# EasyEDA Pro project ProProject_STM Embedded BD_2024-04-18.epro

# Schematic ATmega Embedded BD
Create Date: 2024-04-15; Page Name: 1 / 1; Project Name: STM Embedded BD; Schematic Name: ATmega Embedded BD; Update Date: 2024-04-16; Company: EasyEDA.com; Drawn: EasyEDA; Page Size: A4; Part Number: JLCPCB-002; Reviewed: EasyEDA; Version: V0.1
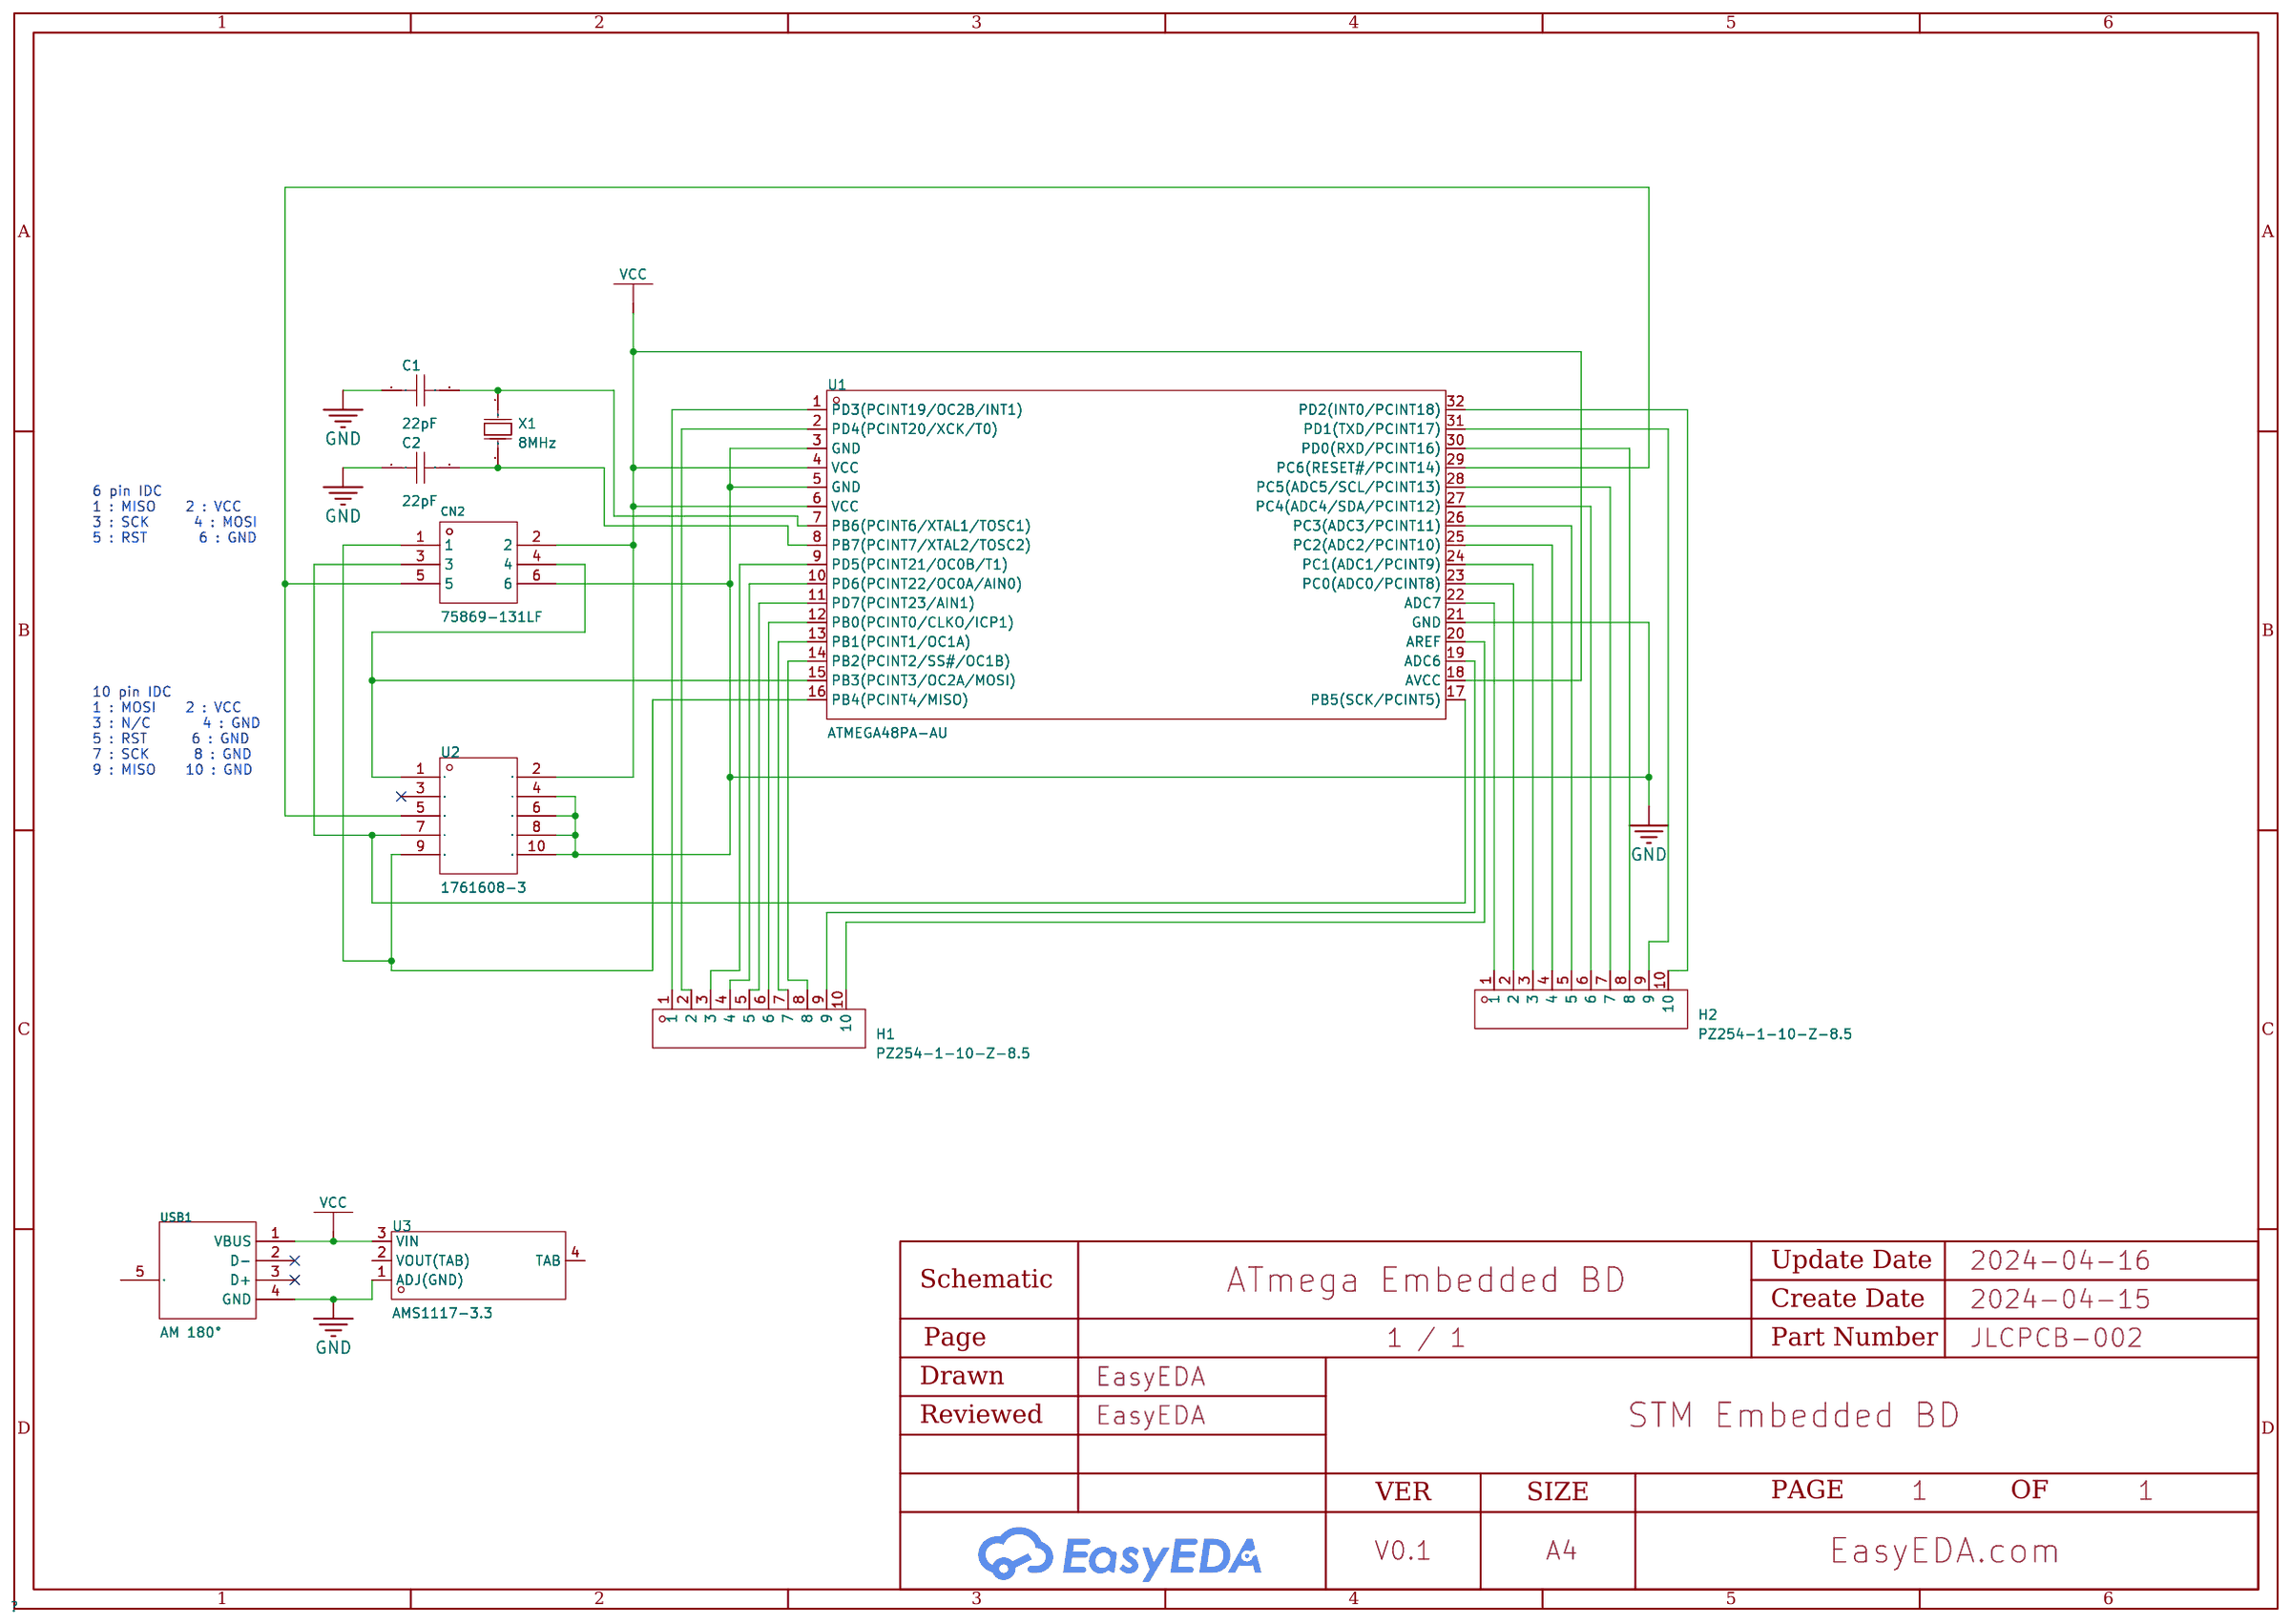
[diagram p0: schematic sheet]

## Parts
C1  22pF  [C0603]
C2  22pF  [C0603]
CN2  75869-131LF  [CONN-TH_6P-P2.54_75869-131LF]
H1  PZ254-1-10-Z-8.5  [HDR-TH_10P-P2.54-V-M]
H2  PZ254-1-10-Z-8.5  [HDR-TH_10P-P2.54-V-M]
U1  ATMEGA48PA-AU  [TQFP-32_L7.0-W7.0-P0.80-LS9.0-BL]
U2  1761608-3  [IDC-TH_10P-P2.54-S2.54_L9.2-W20.3]
U3  AMS1117-3.3  [SOT-223-4_L6.5-W3.5-P2.30-LS7.0-BR]
USB1  AM 180°  [USB-SMD_AM180]
X1  8MHz  [CRYSTAL-SMD_L11.5-W4.8-LS12.7]

## Library data of the parts
C1 C2 = 0603CG220J500NT: Capacitance: Tolerance:±5% Tolerance:±5% Voltage Rated: Temperature Coefficient:; LCSC Part Name: 22pF ±5% 50V; Supplier Part: C91701; Manufacturer: FH(风华); Supplier Footprint: 0603; JLCPCB Part Class: Extended Part; Datasheet: https://atta.szlcsc.com/upload/public/pdf/source/20200305/C486355_26A10D38EF8C2A5C37091D0039909270.pdf; Supplier: LCSC; Tolerance: ±5%
CN2 = 75869-131LF: Pins Structure:2x3P Pitch:2.54mm Mounting Style:Straight Reference Series:- Number of Pins:6P Number of Rows:2 Number of PINs Per Row:3 Row Spacing:2.54mm Contact Material:Phosphor bronze Contact Plating:Tin; LCSC Part Name: 间距:2.54mm 2x3P 直插 蓝色; Supplier Part: C168680; Manufacturer: Amphenol; Supplier Footprint: 插件,P=2.54mm; JLCPCB Part Class: Extended Part; Datasheet: https://atta.szlcsc.com/upload/public/pdf/source/20180316/C63A43DF70B4EBFBD28CCA94FAEE0128.pdf; Supplier: LCSC; Pins Structure: 2x3P; Pitch: 2.54mm; Mounting Style: Straight; Number of Pins: 6P; Number of Rows: 2; Number of PINs Per Row: 3; Row Spacing: 2.54mm; Contact Material: Phosphor bronze; Contact Plating: Tin
H1 H2 = PZ254-1-10-Z-8.5: Pin Structure:1x10P Pitch:2.54mm Row Spacing:- Circluar Pins/Square Pins:Square Pins Mounting Type:Straight Number of Rows:Plugin Number of Pins:10P Current Rating (Max):3A Voltage Rating (Max):- Length of Mating Pin:6mm Insulation Height:2.5mm Length of; LCSC Part Name: 1x10P 间距:2.54mm 方针 直插; Supplier Part: C2894933; Manufacturer: HCTL(华灿天禄); Supplier Footprint: 插件,P=2.54mm; JLCPCB Part Class: Extended Part; Datasheet: https://atta.szlcsc.com/upload/public/pdf/source/20240305/0F0A2A5C422E5D195558C9C26715A031.pdf; Supplier: LCSC; Pin Structure: 1x10P; Pitch: 2.54mm; Circluar Pins/Square Pins: Square Pins; Mounting Type: Straight; Number of Rows: Plugin; Number of Pins: 10P; Current Rating (Max): 3A; Length of Mating Pin: 6mm; Insulation Height: 2.5mm; Length of End Connection Pin: 3mm; Operating Temperature Range: -40℃~+105℃; Soldering Temperature(Max): 260℃@10S; Color: Black
U1 = ATMEGA48PA-AU: CPU Core:AVR Program Storage Size:4KB GPIO Ports Number:23 Operating Voltage Range:1.8V~5.5V Operating Voltage Range:1.8V~5.5V CPU Maximum Speed:20MHz Operating Temperature Range:-40℃~+85℃ Operating Temperature Range:-40℃~+85℃ ADC (Bit):10bit Watchdog:有 L; LCSC Part Name: 基于AVR增强型RISC架构的低功耗CMOS 8位微控制器; Supplier Part: C9433; Manufacturer: MICROCHIP(美国微芯); Supplier Footprint: TQFP-32(7x7); JLCPCB Part Class: Extended Part; Datasheet: https://atta.szlcsc.com/upload/public/pdf/source/20140724/1457707175179.pdf; Supplier: LCSC; CPU Core: AVR; Program Storage Size: 4KB; GPIO Ports Number: 23; Operating Voltage Range: 1.8V~5.5V; CPU Maximum Speed: 20MHz; Operating Temperature Range: -40℃~+85℃; ADC (Bit): 10bit; Watchdog: 有; Low-Voltage Detect: 有; Internal Oscillator: 有
U2 = 1761608-3: Pins Structure:2x5P Pitch:2.54mm Mounting Style:Straight Reference Series:- Number of Pins:10P Number of Rows:2 Number of PINs Per Row:5 Row Spacing:2.54mm Current Rating (Max):1A Contact Material:Phosphor bronze Contact Plating:Tin Operating Temperature; Supplier Part: C305912; Manufacturer: TE Connectivity(泰科电子); Supplier Footprint: 插件,P=2.5mm; JLCPCB Part Class: Extended Part; Datasheet: https://atta.szlcsc.com/upload/public/pdf/source/20181023/C305913_13B9A14E6BC94F99D9146D7418167983.pdf; Supplier: LCSC; Pins Structure: 2x5P; Pitch: 2.54mm; Mounting Style: Straight; Number of Pins: 10P; Number of Rows: 2; Number of PINs Per Row: 5; Row Spacing: 2.54mm; Current Rating (Max): 1A; Contact Material: Phosphor bronze; Contact Plating: Tin; Operating Temperature Range: -65℃~+105℃
U3 = AMS1117-3.3_C347222: Output Type: Maximum Input Voltage:12V Output Voltage:3.3V Output Voltage:3.3V MAX Output Current:1A Power Supply Rejection Ratio (PSRR):60dB@(120Hz) Dropout Voltage:1.3V@(1A) standby current:- Noise:- Feature:- Operating Temperature:- Operating Temperatu; LCSC Part Name: 输出:3.3V 电流:1A 耐压:12V; Supplier Part: C347222; Manufacturer: UMW(友台半导体); Supplier Footprint: SOT-223; JLCPCB Part Class: Extended Part; Datasheet: https://atta.szlcsc.com/upload/public/pdf/source/20231109/155D79A26D9DB04352555A58D5969DC8.pdf; Supplier: LCSC; Maximum Input Voltage: 12V; Output Voltage: 3.3V; MAX Output Current: 1A; Power Supply Rejection Ratio (PSRR): 60dB@(120Hz); Dropout Voltage: 1.3V@(1A); Output Polarity: Positive electrode; Number of Outputs: 1
USB1 = AM 180°: Connector Type:Type-A Standard:USB 2.0 Gender:公 Number of Ports:1 Number of Contacts:4P Mounting Style:卧贴 Current Rating - Power (Max):1A Operating Temperature Range:-40℃~+60℃ Operating Temperature Range:-40℃~+60℃; LCSC Part Name: Type-A 公 卧贴; Supplier Part: C2681564; Manufacturer: SHOU HAN(首韩); Supplier Footprint: SMD; JLCPCB Part Class: Extended Part; Datasheet: https://atta.szlcsc.com/upload/public/pdf/source/20210107/C2681564_25DA62A2D5638CEDBC3A14F60B11E72F.pdf; Supplier: LCSC; Connector Type: Type-A; Standard: USB 2.0; Gender: 公; Number of Ports: 1; Number of Contacts: 4P; Mounting Style: 卧贴; Current Rating - Power (Max): 1A; Operating Temperature Range: -40℃~+60℃
X1 = X49SM8MSD2SC: Crystal Type:贴片晶振 Frequency: Normal temperature Frequency Tolerance:±20ppm Normal temperature Frequency Tolerance:±20ppm External load capacitor: Frequency Stability(Full temperature range):±30ppm Frequency Stability(Full temperature range):±30ppm Operati; LCSC Part Name: 8MHz ±20ppm 20pF; Supplier Part: C12674; Manufacturer: YXC(扬兴晶振); Supplier Footprint: HC-49S-SMD; JLCPCB Part Class: Basic Part; Datasheet: https://atta.szlcsc.com/upload/public/pdf/source/20240329/3EBF42EBCAB50CA65B6FA9D7CFA1955A.pdf; Supplier: LCSC; Crystal Type: 贴片晶振; Normal temperature Frequency Tolerance: ±20ppm; Frequency Stability(Full temperature range): ±30ppm

## Nets
GND: C1.1 C2.1 CN2.6 U1.3(GND) U1.5(GND) U1.21(GND) U2.4 U2.6 U2.8 U2.10 U3.1(ADJ(GND)) USB1.4(GND)
VCC: CN2.2 U1.4(VCC) U1.6(VCC) U1.18(AVCC) U2.2 U3.3(VIN) USB1.1(VBUS)
$2N830: CN2.4 U1.15(PB3(PCINT3/OC2A/MOSI)) U2.1
$2N839: CN2.1 U1.16(PB4(PCINT4/MISO)) U2.9
$2N858: CN2.3 U1.17(PB5(SCK/PCINT5)) U2.7
$2N878: CN2.5 U1.29(PC6(RESET#/PCINT14)) U2.5
$2N1111: C1.2 U1.7(PB6(PCINT6/XTAL1/TOSC1)) X1.1(OSC1)
$2N1119: C2.2 U1.8(PB7(PCINT7/XTAL2/TOSC2)) X1.2(OSC2)
$2N1346: H1.1 U1.1(PD3(PCINT19/OC2B/INT1))
$2N1350: H1.2 U1.2(PD4(PCINT20/XCK/T0))
$2N1360: H1.3 U1.9(PD5(PCINT21/OC0B/T1))
$2N1374: H1.4 U1.10(PD6(PCINT22/OC0A/AIN0))
$2N1380: H1.5 U1.11(PD7(PCINT23/AIN1))
$2N1390: H1.6 U1.12(PB0(PCINT0/CLKO/ICP1))
$2N1398: H1.7 U1.13(PB1(PCINT1/OC1A))
$2N1410: H1.8 U1.14(PB2(PCINT2/SS#/OC1B))
$2N1422: H1.9 U1.19(ADC6)
$2N1434: H1.10 U1.20(AREF)
$2N1448: H2.1 U1.22(ADC7)
$2N1452: H2.2 U1.23(PC0(ADC0/PCINT8))
$2N1456: H2.3 U1.24(PC1(ADC1/PCINT9))
$2N1460: H2.4 U1.25(PC2(ADC2/PCINT10))
$2N1464: H2.5 U1.26(PC3(ADC3/PCINT11))
$2N1472: H2.6 U1.27(PC4(ADC4/SDA/PCINT12))
$2N1480: H2.7 U1.28(PC5(ADC5/SCL/PCINT13))
$2N1488: H2.8 U1.30(PD0(RXD/PCINT16))
$2N1496: H2.9 U1.31(PD1(TXD/PCINT17))
$2N1514: H2.10 U1.32(PD2(INT0/PCINT18))

Not connected (* = marked no-connect by the designer): U2 3*; U3 2(VOUT(TAB)) 4(TAB); USB1 2(D-)* 3(D+)* 5(EH)

## Notes on the sheet
- 6 pin IDC
  1 : MISO    2 : VCC
  3 : SCK      4 : MOSI
  5 : RST       6 : GND
- 10 pin IDC
  1 : MOSI    2 : VCC
  3 : N/C       4 : GND
  5 : RST      6 : GND
  7 : SCK      8 : GND
  9 : MISO    10 : GND

# Schematic STM32 Embedded BD
Create Date: 2024-04-15; Page Name: 1 / 1; Project Name: STM Embedded BD; Schematic Name: STM32 Embedded BD; Update Date: 2024-04-16; Company: EasyEDA.com; Drawn: EasyEDA; Page Size: A4; Part Number: JLCPCB-002; Reviewed: EasyEDA; Version: V0.1
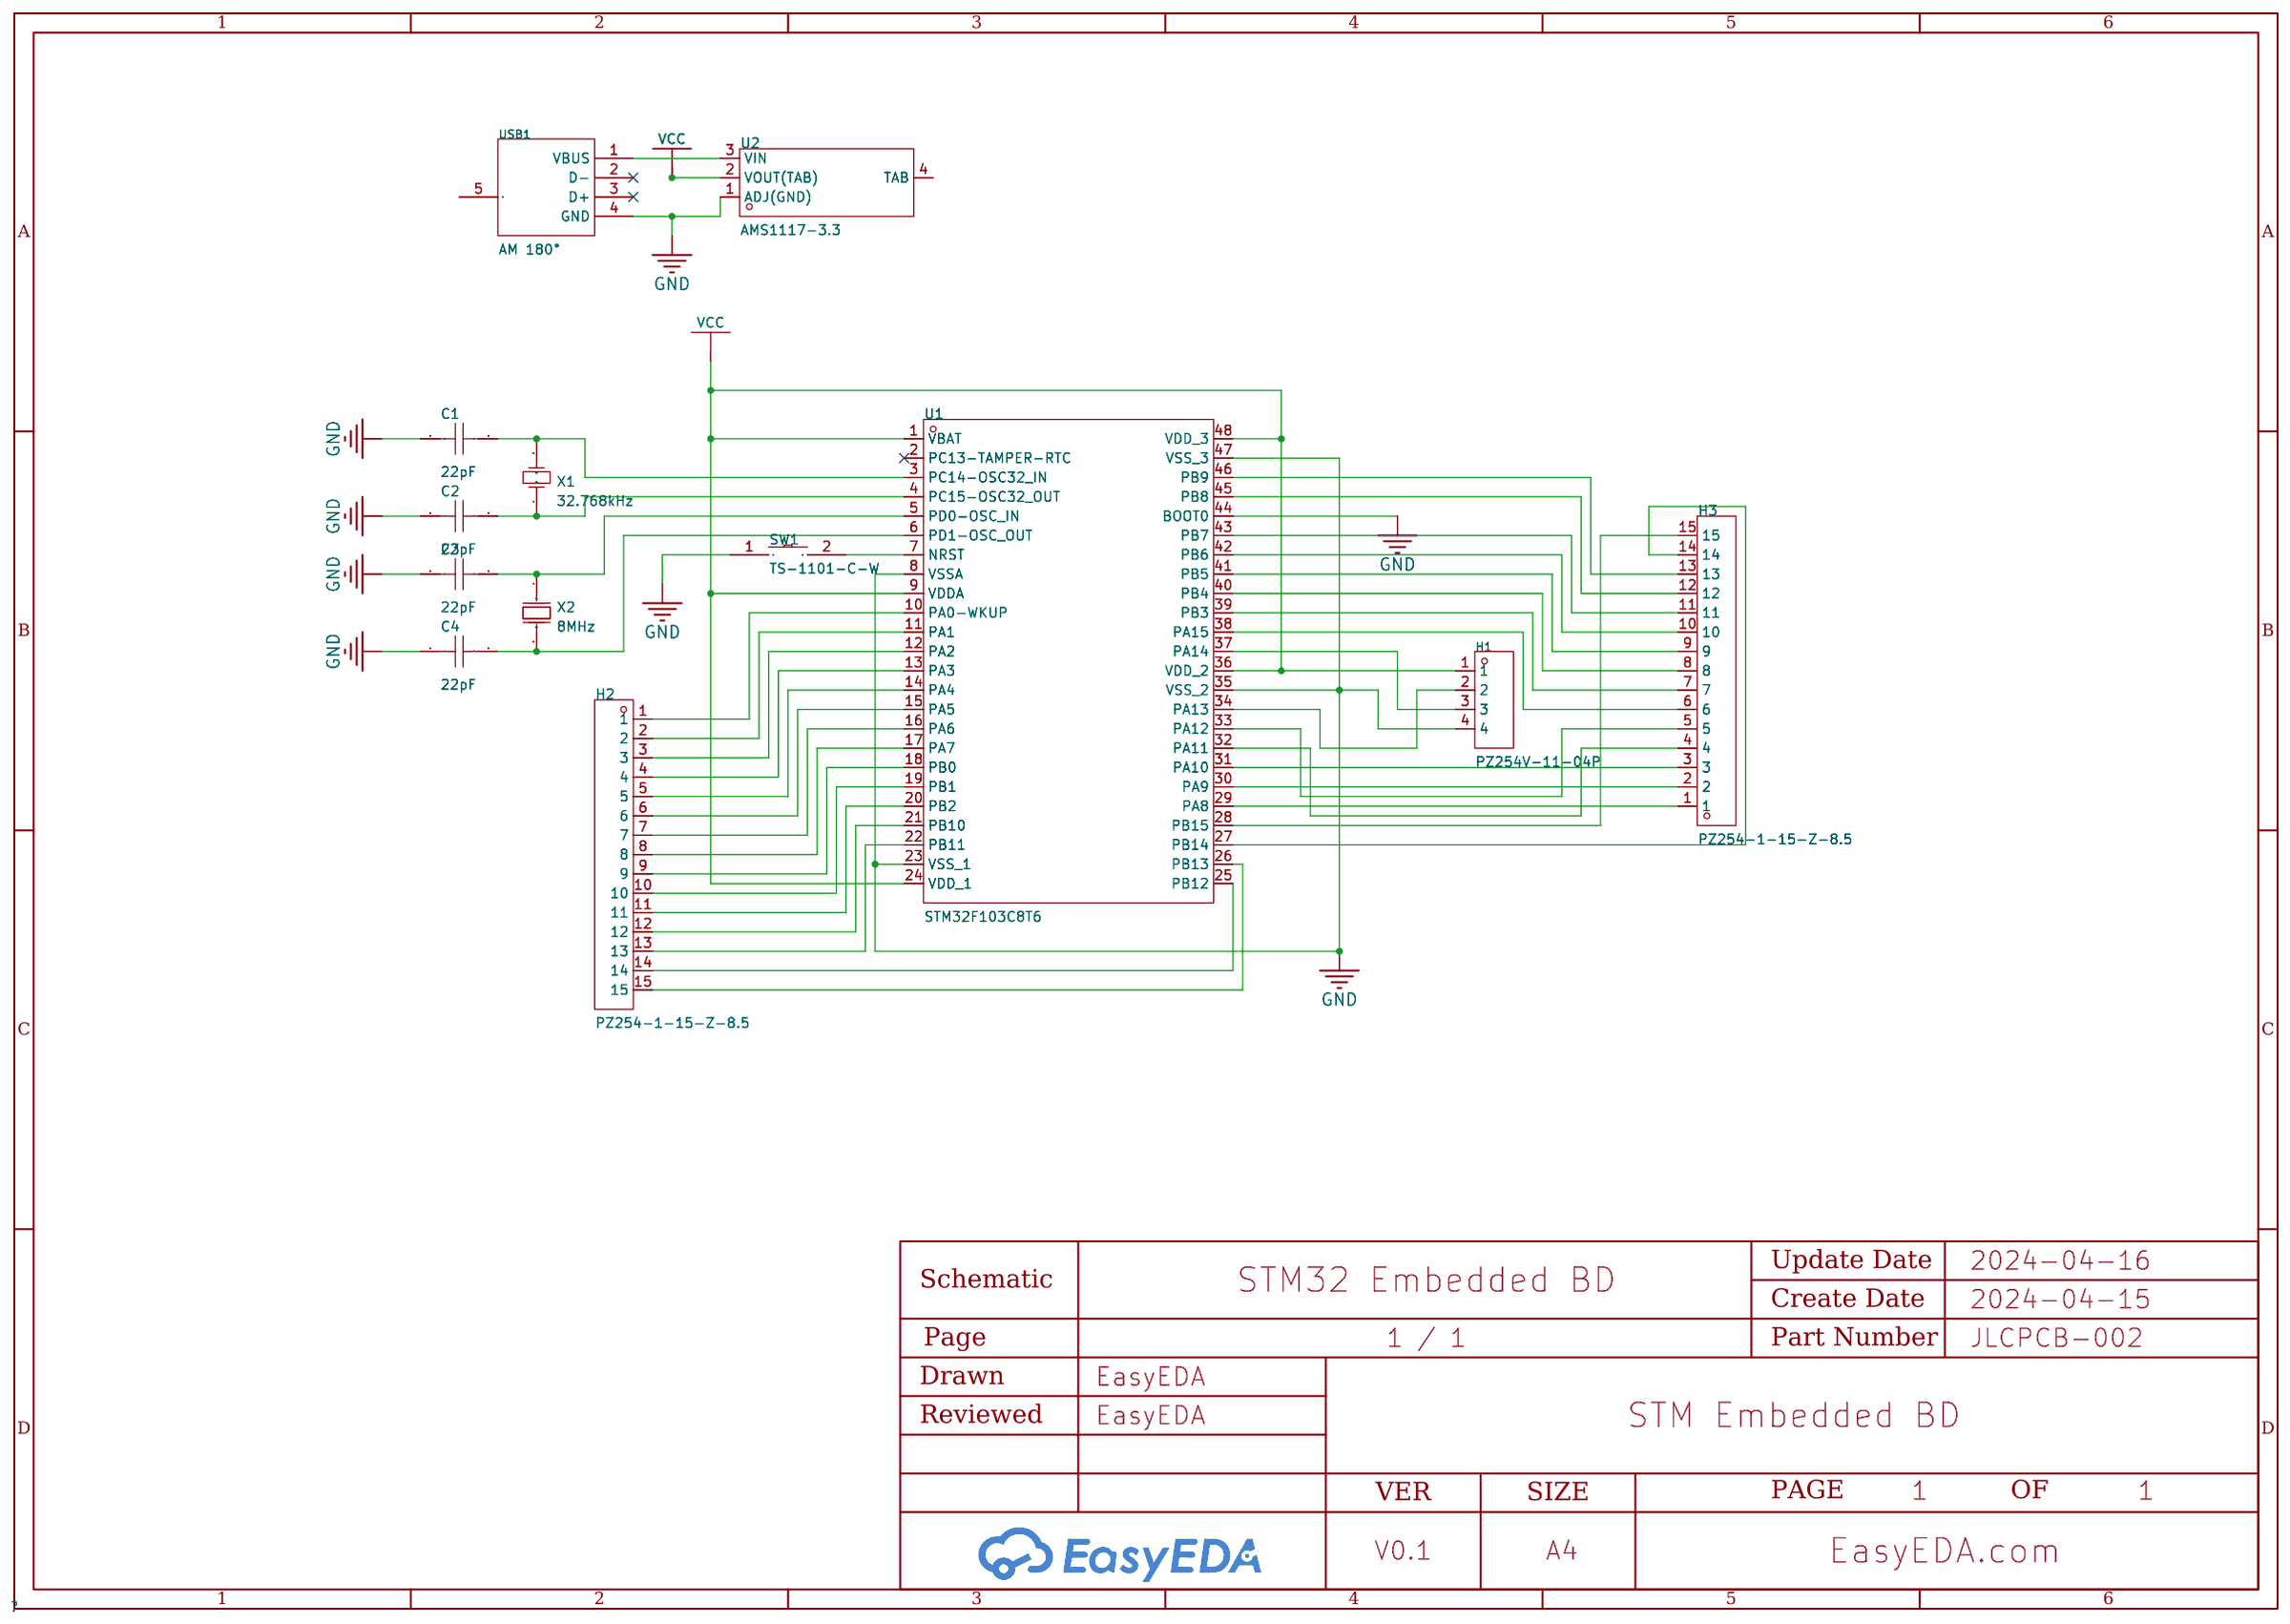
[diagram p1: schematic sheet]

## Parts
C1  22pF  [C0603]
C2  22pF  [C0603]
C3  22pF  [C0603]
C4  22pF  [C0603]
H1  PZ254V-11-04P  [HDR-TH_4P-P2.54-V-M]
H2  PZ254-1-15-Z-8.5  [HDR-TH_15P-P2.54-V-M]
H3  PZ254-1-15-Z-8.5  [HDR-TH_15P-P2.54-V-M]
SW1  TS-1101-C-W  [SW-SMD_L6.0-W3.3-LS8.0]
U1  STM32F103C8T6  [LQFP-48_L7.0-W7.0-P0.50-LS9.0-BL]
U2  AMS1117-3.3  [SOT-223-4_L6.5-W3.5-P2.30-LS7.0-BR]
USB1  AM 180°  [USB-SMD_AM180]
X1  32.768kHz  [OSC-TH_BD3.1-P0.8-D0.3]
X2  8MHz  [CRYSTAL-SMD_L11.5-W4.8-LS12.7]

## Library data of the parts
C1-C4 = 0603CG220J500NT: Capacitance: Tolerance:±5% Tolerance:±5% Voltage Rated: Temperature Coefficient:; LCSC Part Name: 22pF ±5% 50V; Supplier Part: C91701; Manufacturer: FH(风华); Supplier Footprint: 0603; JLCPCB Part Class: Extended Part; Datasheet: https://atta.szlcsc.com/upload/public/pdf/source/20200305/C486355_26A10D38EF8C2A5C37091D0039909270.pdf; Supplier: LCSC; Tolerance: ±5%
H1 = PZ254V-11-04P: Pin Structure:1x4P Pitch:2.54mm Row Spacing:- Circluar Pins/Square Pins:Square Pins Mounting Type:Straight Number of Rows:Plugin Number of Pins:4P Current Rating (Max):3A Voltage Rating (Max):250V Length of Mating Pin:6mm Insulation Height:2.5mm Length of; LCSC Part Name: 间距:2.54mm 1x4P 直插 方针; Supplier Part: C2691448; Manufacturer: XFCN(兴飞); Supplier Footprint: 插件,P=2.54mm; JLCPCB Part Class: Extended Part; Datasheet: https://atta.szlcsc.com/upload/public/pdf/source/20200309/C492403_F9F19131791D08044AD4F84F8E751A34.pdf; Supplier: LCSC; Pin Structure: 1x4P; Pitch: 2.54mm; Circluar Pins/Square Pins: Square Pins; Mounting Type: Straight; Number of Rows: Plugin; Number of Pins: 4P; Current Rating (Max): 3A; Voltage Rating (Max): 250V; Length of Mating Pin: 6mm; Insulation Height: 2.5mm; Length of End Connection Pin: 3mm; Operating Temperature Range: -40℃~+105℃; Color: Black
H2 H3 = PZ254-1-15-Z-8.5_C2894938: Pin Structure:1x15P Pitch:2.54mm Row Spacing:- Circluar Pins/Square Pins:Square Pins Mounting Type:Straight Number of Rows:Plugin Number of Pins:15P Current Rating (Max):3A Voltage Rating (Max):- Length of Mating Pin:6mm Insulation Height:2.5mm Length of; LCSC Part Name: 1x15P 间距:2.54mm 方针 直插; Supplier Part: C2894938; Manufacturer: HCTL(华灿天禄); Supplier Footprint: 插件,P=2.54mm; JLCPCB Part Class: Extended Part; Datasheet: https://atta.szlcsc.com/upload/public/pdf/source/20230609/805D25CEF03592837AF6F506EEB5ED41.pdf; Supplier: LCSC; Pin Structure: 1x15P; Pitch: 2.54mm; Circluar Pins/Square Pins: Square Pins; Mounting Type: Straight; Number of Rows: Plugin; Number of Pins: 15P; Current Rating (Max): 3A; Length of Mating Pin: 6mm; Insulation Height: 2.5mm; Length of End Connection Pin: 3mm; Operating Temperature Range: -40℃~+105℃; Soldering Temperature(Max): 260℃@10S; Color: Black
SW1 = TS-1101-C-W: Circuit:SPST Actuator Style:Rectangle button Operating Force:260gf Mounting Style:Brick nogging Switch Length:6mm Switch Width:3.6mm Switch Height:2.5mm Strike Gundam:不带 Contact Current:50mA Voltage Rating (AC):- Voltage Rating (DC):12V Power Rating:- Ins; LCSC Part Name: 6*3.6*2.5mm 立贴 轻触开关; Supplier Part: C318938; Manufacturer: XKB Connectivity(中国星坤); Supplier Footprint: SMD; JLCPCB Part Class: Extended Part; Datasheet: https://atta.szlcsc.com/upload/public/pdf/source/20200227/C318938_C2E53B1EEDE37D980A33616AC086DE53.pdf; Supplier: LCSC; Circuit: SPST; Actuator Style: Rectangle button; Operating Force: 260gf; Mounting Style: Brick nogging; Switch Length: 6mm; Switch Width: 3.6mm; Switch Height: 2.5mm; Strike Gundam: 不带; Contact Current: 50mA; Voltage Rating (DC): 12V; Actuator/Cap Color: 白色带淡绿; With Lamp: No; Mechanical Life: 5万次; Operating Temperature: -30℃~+85℃
U1 = STM32F103C8T6: CPU Core:CM3 Program Storage Size:64KB RAM Size:20KB GPIO Ports Number:37 Operating Voltage Range:2V~3.6V Operating Voltage Range:2V~3.6V CPU Maximum Speed:72MHz Program Memory Type:FLASH Operating Temperature Range:-40℃~+85℃ Operating Temperature Range:-; LCSC Part Name: STM32F103C8T6 MSL=3; Supplier Part: C8734; Manufacturer: ST(意法半导体); Supplier Footprint: LQFP-48(7x7); JLCPCB Part Class: Extended Part; Datasheet: https://atta.szlcsc.com/upload/public/pdf/source/20220812/8363ACEC51AD55ECEB84799464F7CB85.pdf; Supplier: LCSC; CPU Core: CM3; Program Storage Size: 64KB; RAM Size: 20KB; GPIO Ports Number: 37; Operating Voltage Range: 2V~3.6V; CPU Maximum Speed: 72MHz; Program Memory Type: FLASH; Operating Temperature Range: -40℃~+85℃; ADC (Bit): 12bit; Universal Serial Bus: 有; Peripheral/Function: WDT；DMA；WDT；On-chip temperature sensor; Watchdog: 有; Infrared Data Association: 有; Low-Voltage Detect: 有; Direct Memory Access: 有; Internal Oscillator: 有
U2 = AMS1117-3.3_C347222: Output Type: Maximum Input Voltage:12V Output Voltage:3.3V Output Voltage:3.3V MAX Output Current:1A Power Supply Rejection Ratio (PSRR):60dB@(120Hz) Dropout Voltage:1.3V@(1A) standby current:- Noise:- Feature:- Operating Temperature:- Operating Temperatu; LCSC Part Name: 输出:3.3V 电流:1A 耐压:12V; Supplier Part: C347222; Manufacturer: UMW(友台半导体); Supplier Footprint: SOT-223; JLCPCB Part Class: Extended Part; Datasheet: https://atta.szlcsc.com/upload/public/pdf/source/20231109/155D79A26D9DB04352555A58D5969DC8.pdf; Supplier: LCSC; Maximum Input Voltage: 12V; Output Voltage: 3.3V; MAX Output Current: 1A; Power Supply Rejection Ratio (PSRR): 60dB@(120Hz); Dropout Voltage: 1.3V@(1A); Output Polarity: Positive electrode; Number of Outputs: 1
USB1 = AM 180°: Connector Type:Type-A Standard:USB 2.0 Gender:公 Number of Ports:1 Number of Contacts:4P Mounting Style:卧贴 Current Rating - Power (Max):1A Operating Temperature Range:-40℃~+60℃ Operating Temperature Range:-40℃~+60℃; LCSC Part Name: Type-A 公 卧贴; Supplier Part: C2681564; Manufacturer: SHOU HAN(首韩); Supplier Footprint: SMD; JLCPCB Part Class: Extended Part; Datasheet: https://atta.szlcsc.com/upload/public/pdf/source/20210107/C2681564_25DA62A2D5638CEDBC3A14F60B11E72F.pdf; Supplier: LCSC; Connector Type: Type-A; Standard: USB 2.0; Gender: 公; Number of Ports: 1; Number of Contacts: 4P; Mounting Style: 卧贴; Current Rating - Power (Max): 1A; Operating Temperature Range: -40℃~+60℃
X1 = X308032768KGB2SC: Crystal Type:直插晶振 Frequency: Normal temperature Frequency Tolerance:±10ppm Normal temperature Frequency Tolerance:±10ppm External load capacitor: Frequency Stability(Full temperature range):- Frequency Stability(Full temperature range):- Operating Tempera; LCSC Part Name: 32.768kHz ±10ppm 12.5pF YT-38; Supplier Part: C52082; Manufacturer: YXC(扬兴晶振); Supplier Footprint: DT-38; JLCPCB Part Class: Extended Part; Datasheet: https://atta.szlcsc.com/upload/public/pdf/source/20240329/231E1A1EB7C875CD193DBE6664A3DE3A.pdf; Supplier: LCSC; Crystal Type: 直插晶振; Normal temperature Frequency Tolerance: ±10ppm
X2 = X49SM8MSD2SC: Crystal Type:贴片晶振 Frequency: Normal temperature Frequency Tolerance:±20ppm Normal temperature Frequency Tolerance:±20ppm External load capacitor: Frequency Stability(Full temperature range):±30ppm Frequency Stability(Full temperature range):±30ppm Operati; LCSC Part Name: 8MHz ±20ppm 20pF; Supplier Part: C12674; Manufacturer: YXC(扬兴晶振); Supplier Footprint: HC-49S-SMD; JLCPCB Part Class: Basic Part; Datasheet: https://atta.szlcsc.com/upload/public/pdf/source/20240329/3EBF42EBCAB50CA65B6FA9D7CFA1955A.pdf; Supplier: LCSC; Crystal Type: 贴片晶振; Normal temperature Frequency Tolerance: ±20ppm; Frequency Stability(Full temperature range): ±30ppm

## Nets
GND: C1.1 C2.1 C3.1 C4.1 H1.4 SW1.1 U1.8(VSSA) U1.23(VSS_1) U1.35(VSS_2) U1.44(BOOT0) U1.47(VSS_3) U2.1(ADJ(GND)) USB1.4(GND)
VCC: H1.1 U1.1(VBAT) U1.9(VDDA) U1.24(VDD_1) U1.36(VDD_2) U1.48(VDD_3) U2.2(VOUT(TAB))
$3N746: U2.3(VIN) USB1.1(VBUS)
$3N1161: H1.3 U1.37(PA14)
$3N1166: H1.2 U1.34(PA13)
$3N1666: C1.2 U1.3(PC14-OSC32_IN) X1.2(OSC2)
$3N1672: C2.2 U1.4(PC15-OSC32_OUT) X1.1(OSC1)
$3N1678: C3.2 U1.5(PD0-OSC_IN) X2.1(OSC1)
$3N1684: C4.2 U1.6(PD1-OSC_OUT) X2.2(OSC2)
$3N2120: SW1.2 U1.7(NRST)
$3N2429: H2.1 U1.10(PA0-WKUP)
$3N2434: H2.2 U1.11(PA1)
$3N2444: H2.3 U1.12(PA2)
$3N2454: H2.4 U1.13(PA3)
$3N2466: H2.5 U1.14(PA4)
$3N2478: H2.6 U1.15(PA5)
$3N2490: H2.7 U1.16(PA6)
$3N2502: H2.8 U1.17(PA7)
$3N2512: H2.9 U1.18(PB0)
$3N2522: H2.10 U1.19(PB1)
$3N2532: H2.11 U1.20(PB2)
$3N2544: H2.12 U1.21(PB10)
$3N2554: H2.13 U1.22(PB11)
$3N2566: H2.14 U1.25(PB12)
$3N2574: H2.15 U1.26(PB13)
$3N2672: H3.1 U1.29(PA8)
$3N2687: H3.2 U1.30(PA9)
$3N2690: H3.3 U1.31(PA10)
$3N2693: H3.4 U1.32(PA11)
$3N2713: H3.5 U1.33(PA12)
$3N2720: H3.6 U1.38(PA15)
$3N2725: H3.7 U1.39(PB3)
$3N2730: H3.8 U1.40(PB4)
$3N2735: H3.9 U1.41(PB5)
$3N2740: H3.10 U1.42(PB6)
$3N2746: H3.11 U1.43(PB7)
$3N2751: H3.12 U1.45(PB8)
$3N2756: H3.13 U1.46(PB9)
$3N2761: H3.14 U1.27(PB14)
$3N2768: H3.15 U1.28(PB15)

Not connected (* = marked no-connect by the designer): U1 2(PC13-TAMPER-RTC)*; U2 4(TAB); USB1 2(D-)* 3(D+)* 5(EH)

# Board PCB1
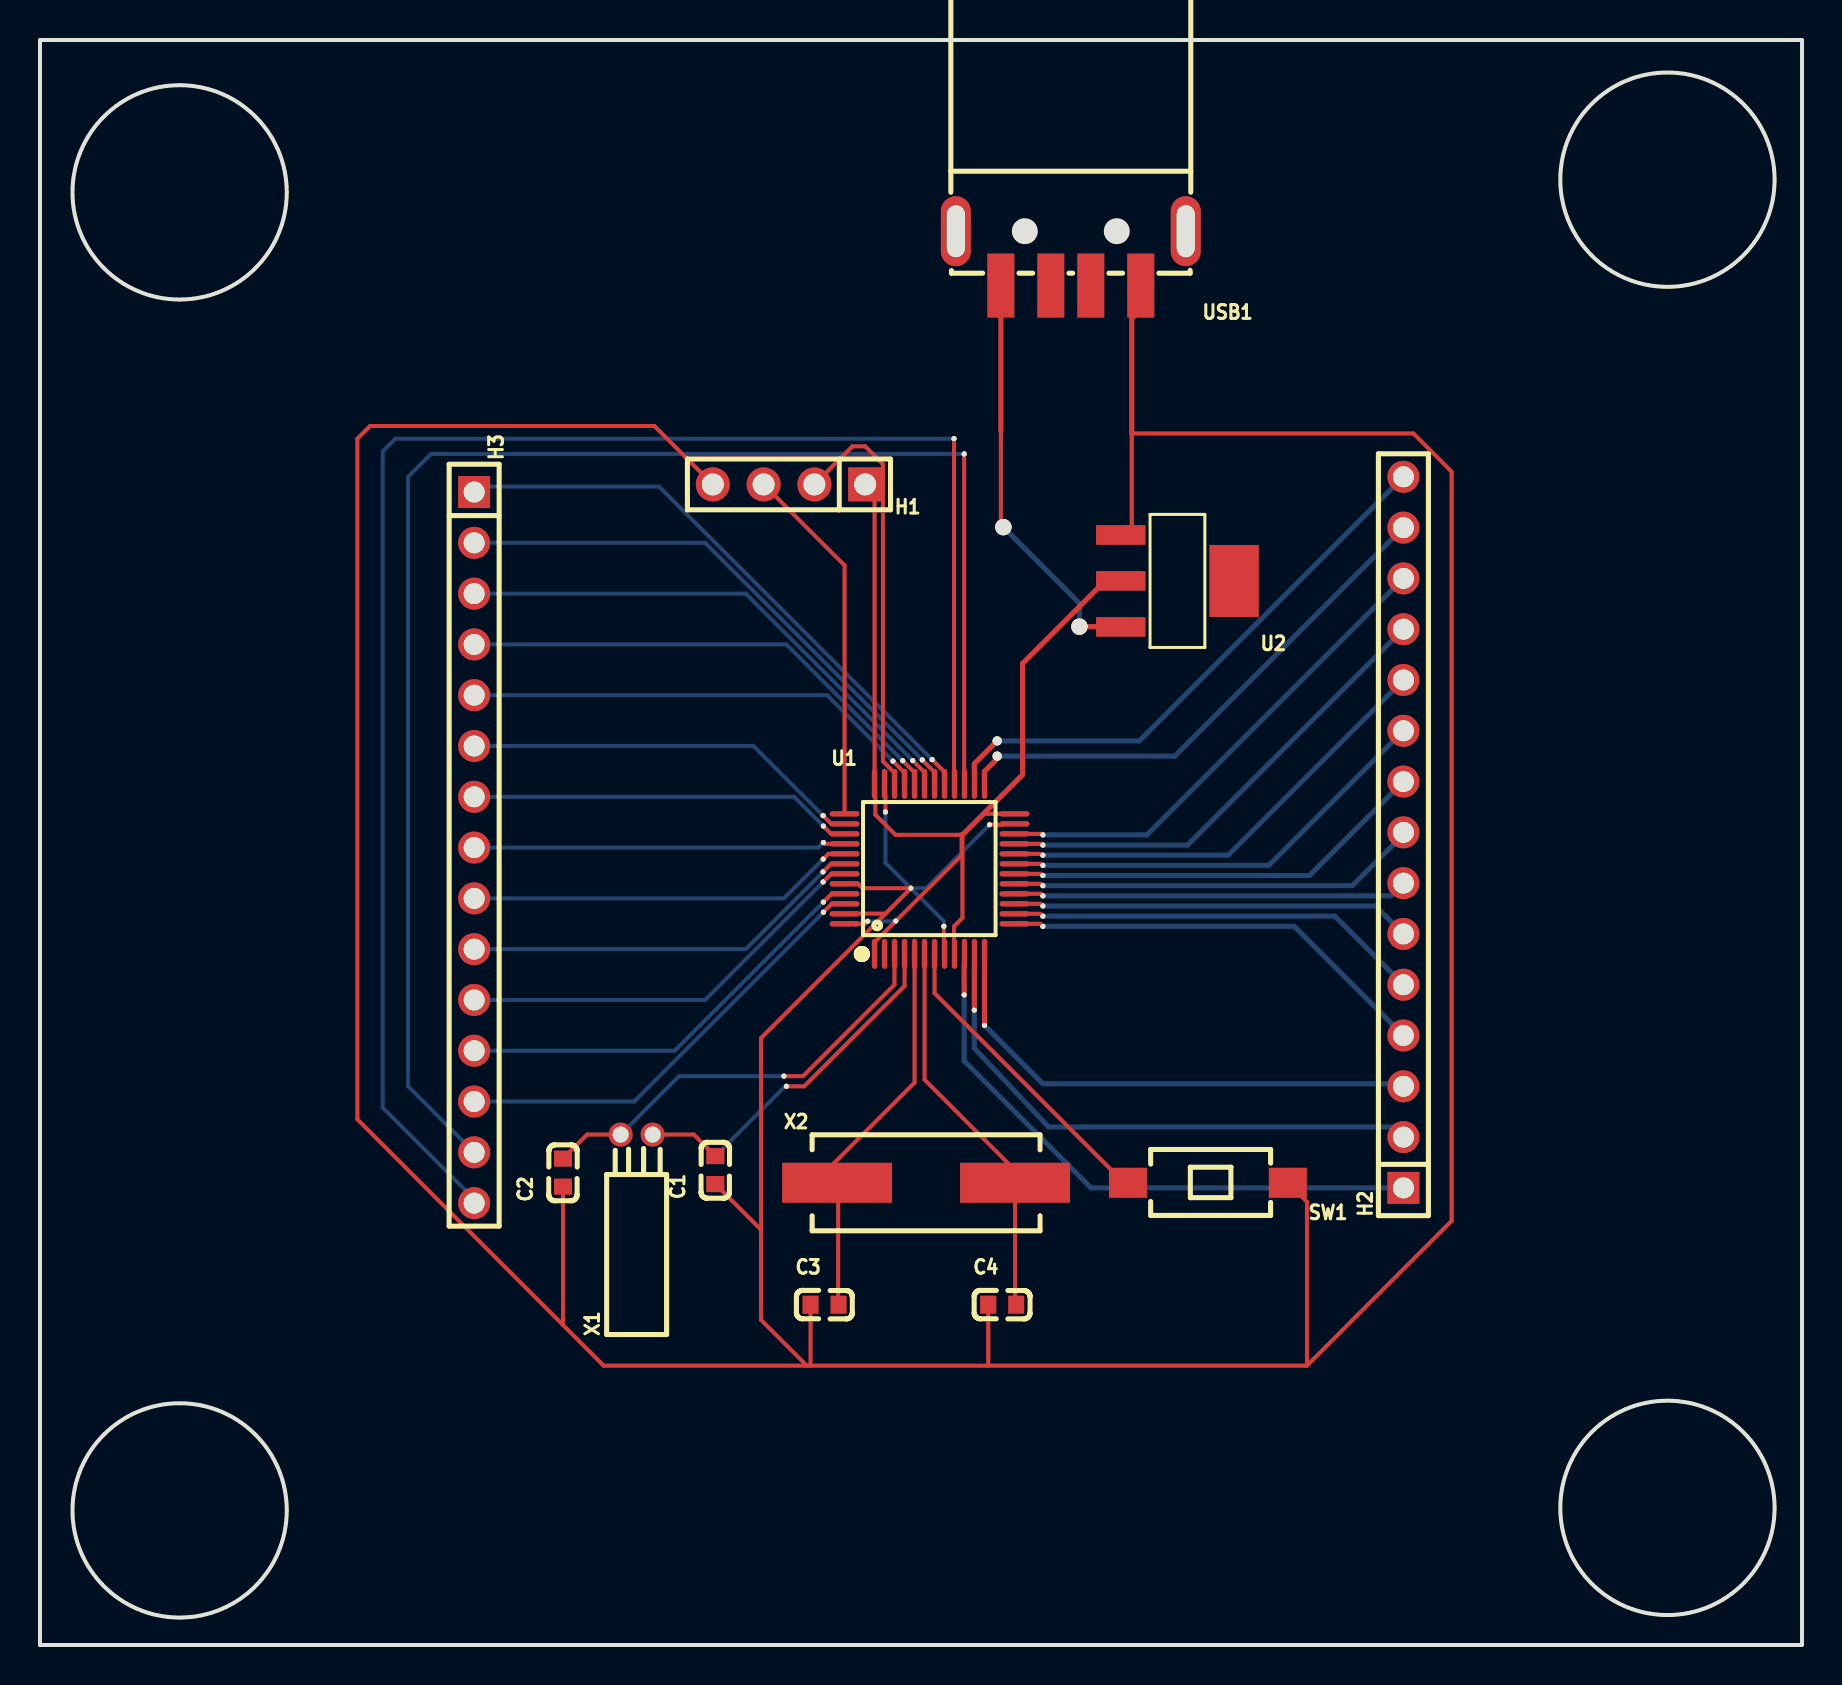
[diagram p2: board, top side]
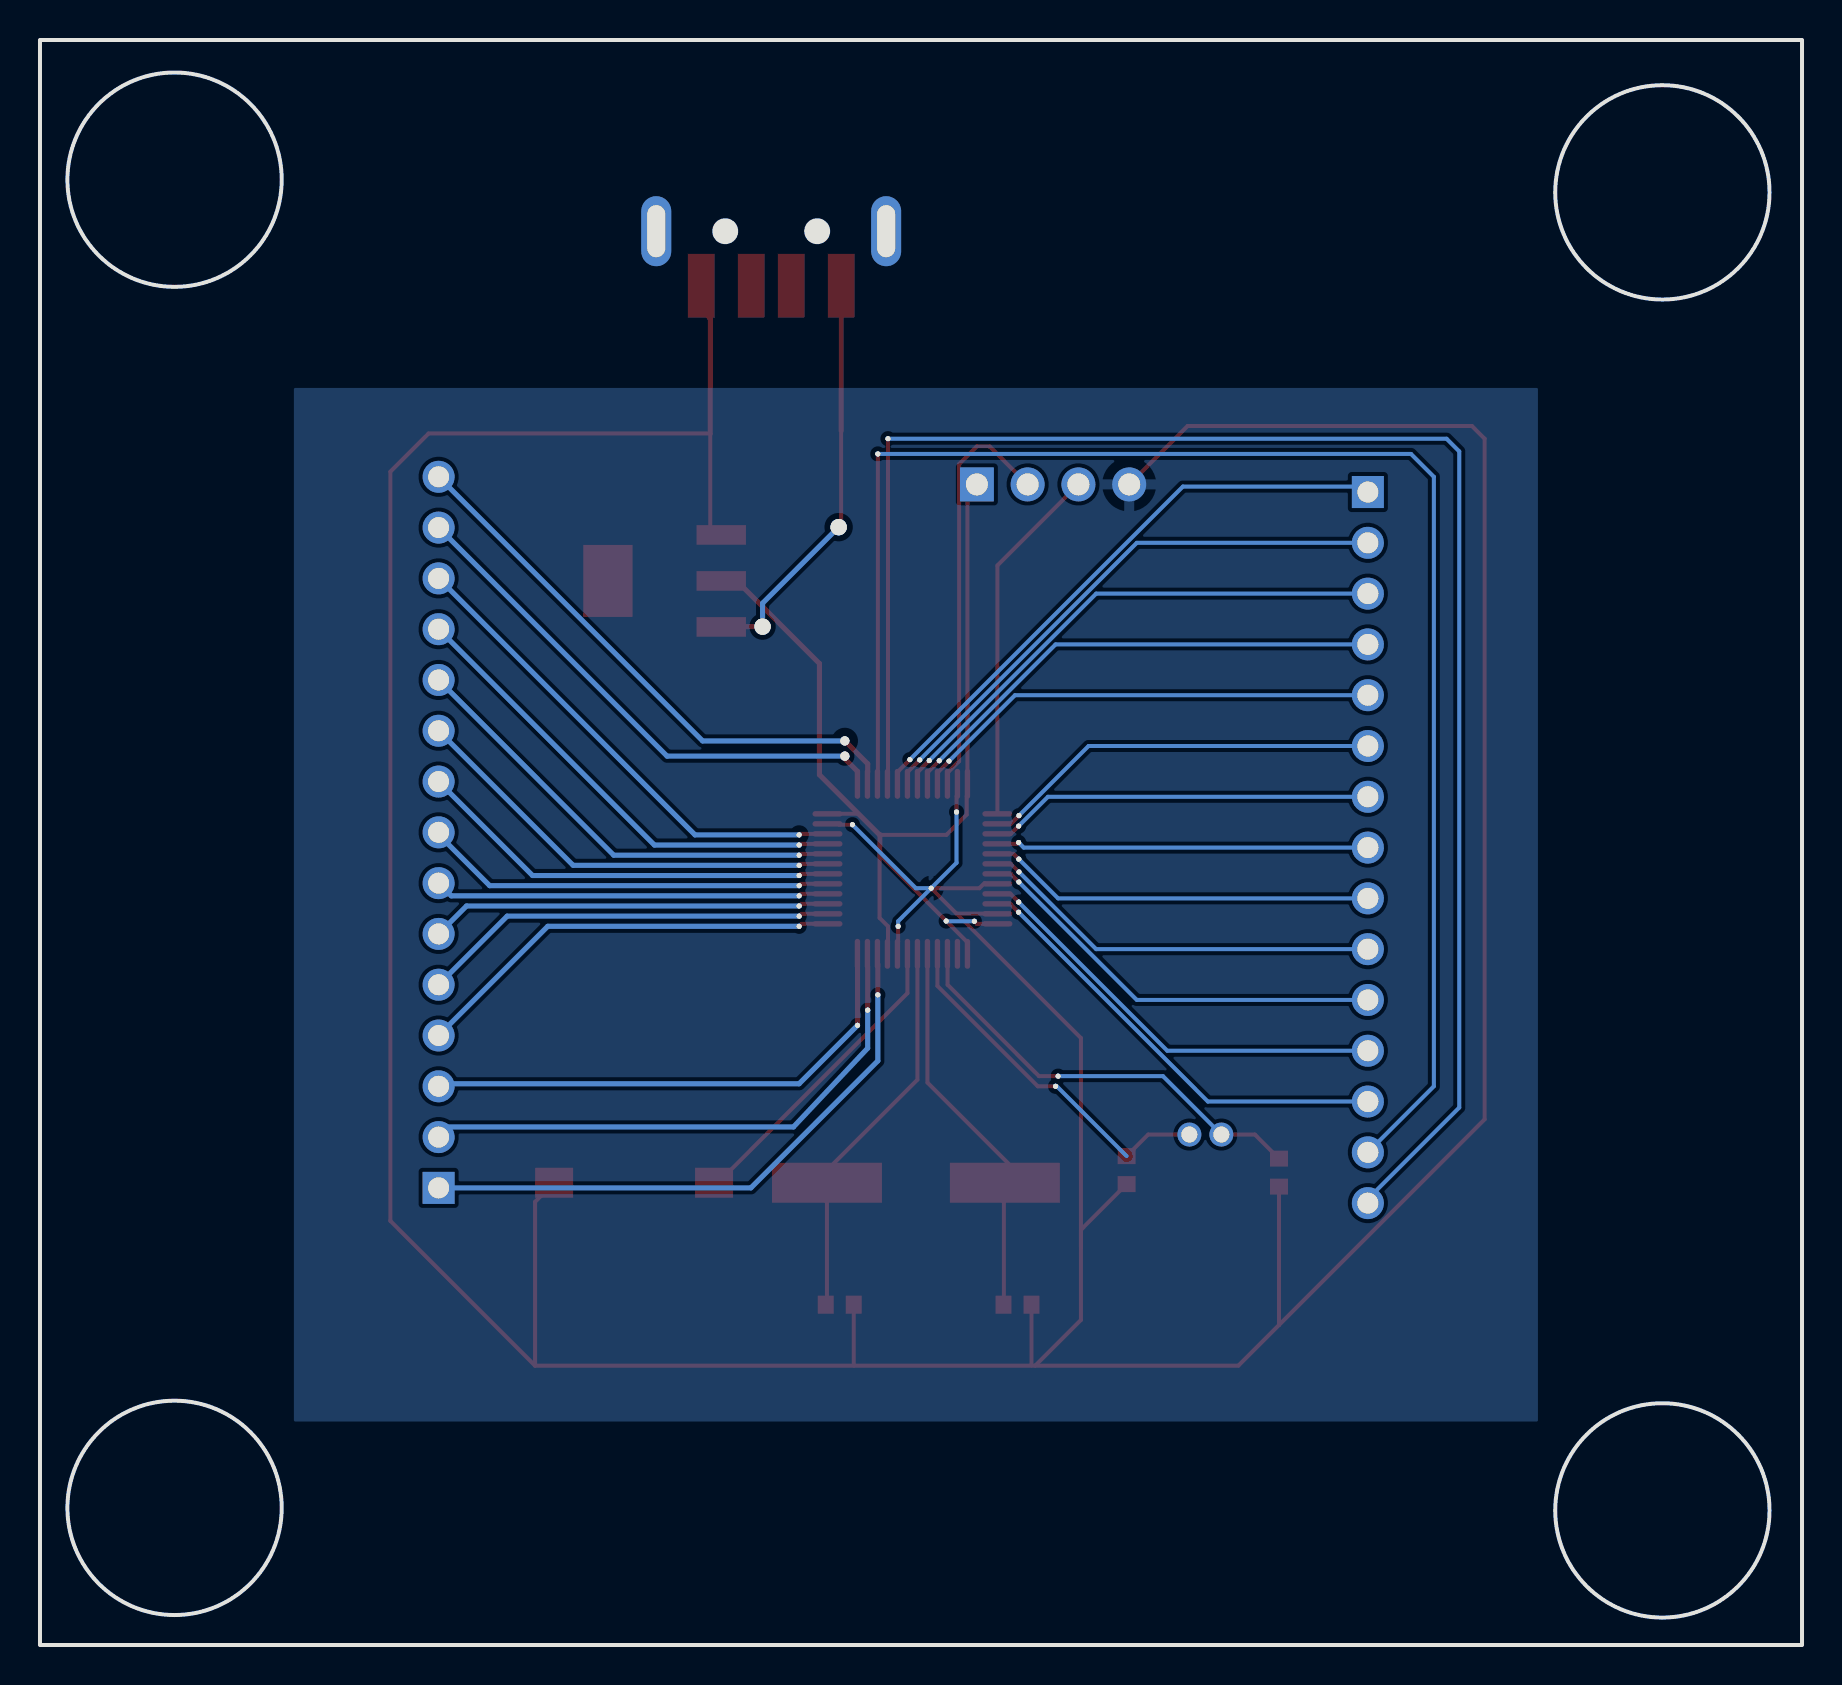
[diagram p3: board, bottom side, seen from below]

Outline 88.14 x 80.26 mm; copper layers: Top Layer, Bottom Layer. Coordinates in mm from the lower left corner of the outline.
Outline path: rectangle 0,80.26 88.14,0 ; circle c6.98,72.64 r5.36 ; circle c6.98,6.73 r5.36 ; circle c81.41,73.28 r5.36 ; circle c81.41,6.86 r5.36
Stack: Top Layer 0.035mm / Dielectric1 1.51mm FR4 er 4.5 / Bottom Layer 0.035mm

## Design rules (mm)
template: JLCPCB Capability(Two Layers Board)
spacing copperThickness1oz (default): track to track 0.102, other pairs 0.152 to 0.3
spacing copperThickness2oz: track to track 0.203, other pairs 0.152 to 0.3
track width copperThickness1oz (default): min 0.127, default 0.254, max 2.54
track width copperThickness2oz: min 0.203, default 0.254, max 2.54
differential pair differentialPair (default): width min 0.127, default 0.254, max 2.54; gap min 0.152, default 0.152
via viaSize (default): diameter min 0.5, default 0.61, max 10; hole min 0.3, default 0.305, max 6.3

## Placement (name value [footprint] x y rotation side)
C1  22pF  [C0603]  33.78 23.75 90 top
C2  22pF  [C0603]  26.16 23.62 90 top
C3  22pF  [C0603]  39.24 17.02 0 top
C4  22pF  [C0603]  48.13 17.02 0 top
H1  PZ254V-11-04P  [HDR-TH_4P-P2.54-V-M]  37.47 58.04 180 top
H2  PZ254-1-15-Z-8.5  [HDR-TH_15P-P2.54-V-M]  68.2 40.64 90 top
H3  PZ254-1-15-Z-8.5  [HDR-TH_15P-P2.54-V-M]  21.72 39.88 270 top
NOREF  -  [Pad_e206]  41.4 36.19 0 top
NOREF#2  -  [Pad_e42]  50.16 39.5 0 top
NOREF#3  -  [Pad_e109]  43.66 44.23 0 top
NOREF#4  -  [Pad_e218]  37.34 27.94 0 top
NOREF#5  -  [Pad_e117]  39.17 38.16 0 top
NOREF#6  -  [Pad_e163]  45.72 60.32 0 top
NOREF#7  -  [Pad_e164]  46.23 59.56 0 top
NOREF#8  -  [Pad_e45]  50.16 38.99 0 top
NOREF#9  -  [Pad_e118]  39.18 37.15 0 top
NOREF#10  -  [Pad_e180]  45.21 35.94 0 top
NOREF#11  -  [Pad_e36]  50.16 40.51 0 top
NOREF#12  -  [Pad_e111]  42.67 44.2 0 top
NOREF#13  -  [Pad_e112]  39.17 41.47 0 top
NOREF#14  -  [Pad_e207]  42.81 36.2 0 top
NOREF#15  -  [Pad_e26]  47.88 45.21 0 top
NOREF#16  -  [Pad_e183]  47.5 41.02 0 top
NOREF#17  -  [Pad_e64]  46.74 31.75 0 top
NOREF#18  -  [Pad_e18]  51.99 50.93 0 top
NOREF#19  -  [Pad_e108]  44.13 44.26 0 top
NOREF#20  -  [Pad_e182]  42.29 41.66 0 top
NOREF#21  -  [Pad_e113]  39.18 40.95 0 top
NOREF#22  -  [Pad_e184]  43.56 37.85 0 top
NOREF#23  -  [Pad_e107]  44.62 44.27 0 top
NOREF#24  -  [Pad_e44]  50.16 38.48 0 top
NOREF#25  -  [Pad_e116]  39.17 38.66 0 top
NOREF#26  -  [Pad_e65]  46.23 32.51 0 top
NOREF#27  -  [Pad_e15]  48.19 55.9 0 top
NOREF#28  -  [Pad_e28]  47.88 44.45 0 top
NOREF#29  -  [Pad_e47]  50.16 37.46 0 top
NOREF#30  -  [Pad_e110]  43.15 44.22 0 top
NOREF#31  -  [Pad_e48]  50.16 36.96 0 top
NOREF#32  -  [Pad_e49]  50.16 36.45 0 top
NOREF#33  -  [Pad_e217]  37.21 28.45 0 top
NOREF#34  -  [Pad_e63]  47.24 30.99 0 top
NOREF#35  -  [Pad_e114]  39.19 40.13 0 top
NOREF#36  -  [Pad_e115]  39.18 39.3 0 top
NOREF#37  -  [Pad_e50]  50.16 35.94 0 top
NOREF#38  -  [Pad_e46]  50.16 37.97 0 top
NOREF#39  -  [Pad_e119]  39.19 36.65 0 top
NOREF#40  -  [Pad_e41]  50.16 40 0 top
SW1  TS-1101-C-W  [SW-SMD_L6.0-W3.3-LS8.0]  58.42 23.11 180 top
U1  STM32F103C8T6  [LQFP-48_L7.0-W7.0-P0.50-LS9.0-BL]  44.5 38.81 0 top
U2  AMS1117-3.3  [SOT-223-4_L6.5-W3.5-P2.30-LS7.0-BR]  56.9 53.21 180 top
USB1  AM 180°  [USB-SMD_AM180]  51.56 69.34 180 top
X1  32.768kHz  [OSC-TH_BD3.1-P0.8-D0.3]  29.84 25.53 90 top
X2  8MHz  [CRYSTAL-SMD_L11.5-W4.8-LS12.7]  44.32 23.11 0 top

## Footprints (pads in the part's own frame, mm; a bottom-side part is the same pattern mirrored in y, then rotated)
C0603
  rect 0.8x0.9 smd: 1(-0.7,0) 2(0.7,0)
CRYSTAL-SMD_L11.5-W4.8-LS12.7
  rect 5.5x2 smd: 1(-4.45,0) 2(4.45,0)
HDR-TH_4P-P2.54-V-M
  rect 1.7x1.7 hole 1.1: 1(-3.81,0)
  round 1.7 hole 1.1: 2(-1.27,0) 3(1.27,0) 4(3.81,0)
HDR-TH_15P-P2.54-V-M
  rect 1.6x1.6 hole 1.05: 1(-17.78,0)
  round 1.6 hole 1.05: 2(-15.24,0) 3(-12.7,0) 4(-10.16,0) 5(-7.62,0) 6(-5.08,0) 7(-2.54,0) 8(0,0) 9(2.54,0) 10(5.08,0) 11(7.62,0) 12(10.16,0) 13(12.7,0) 14(15.24,0) 15(17.78,0)
LQFP-48_L7.0-W7.0-P0.50-LS9.0-BL
  oval 0.27x1.5 smd: 1(-2.75,-4.25) 2(-2.25,-4.25) 3(-1.75,-4.25) 4(-1.25,-4.25) 5(-0.75,-4.25) 6(-0.25,-4.25) 7(0.25,-4.25) 8(0.75,-4.25) 9(1.25,-4.25) 10(1.75,-4.25) 11(2.25,-4.25) 12(2.75,-4.25) 25(2.75,4.25) 26(2.25,4.25) 27(1.75,4.25) 28(1.25,4.25) 29(0.75,4.25) 30(0.25,4.25) 31(-0.25,4.25) 32(-0.75,4.25) 33(-1.25,4.25) 34(-1.75,4.25) 35(-2.25,4.25) 36(-2.75,4.25)
  oval 1.5x0.27 smd: 13(4.25,-2.75) 14(4.25,-2.25) 15(4.25,-1.75) 16(4.25,-1.25) 17(4.25,-0.75) 18(4.25,-0.25) 19(4.25,0.25) 20(4.25,0.75) 21(4.25,1.25) 22(4.25,1.75) 23(4.25,2.25) 24(4.25,2.75) 37(-4.25,2.75) 38(-4.25,2.25) 39(-4.25,1.75) 40(-4.25,1.25) 41(-4.25,0.75) 42(-4.25,0.25) 43(-4.25,-0.25) 44(-4.25,-0.75) 45(-4.25,-1.25) 46(-4.25,-1.75) 47(-4.25,-2.25) 48(-4.25,-2.75)
OSC-TH_BD3.1-P0.8-D0.3
  round 1.2 hole 0.8: 1(0,0.8) 2(0,-0.8)
Pad_e15
  round 0.813 hole 0.914x0.813: 49(0,0)
Pad_e18
  round 0.813 hole 0.813: 50(0,0)
Pad_e26
  round 0.457 hole 0.813x0.457: 51(0,0)
Pad_e28
  round 0.457 hole 0.457: 51(0,0)
Pad_e36
  round 0.254 hole 0.457x0.254: 52(0,0)
Pad_e41
  round 0.254 hole 0.254: 52(0,0)
Pad_e42
  round 0.254 hole 0.254: 52(0,0)
Pad_e44
  round 0.254 hole 0.254: 52(0,0)
Pad_e45
  round 0.254 hole 0.254: 52(0,0)
Pad_e46
  round 0.254 hole 0.254: 52(0,0)
Pad_e47
  round 0.254 hole 0.254: 52(0,0)
Pad_e48
  round 0.254 hole 0.254: 52(0,0)
Pad_e49
  round 0.254 hole 0.254: 52(0,0)
Pad_e50
  round 0.254 hole 0.254: 52(0,0)
Pad_e63
  round 0.254 hole 0.254: 52(0,0)
Pad_e64
  round 0.254 hole 0.254: 53(0,0)
Pad_e65
  round 0.254 hole 0.254: 54(0,0)
Pad_e107
  round 0.254 hole 0.254: 55(0,0)
Pad_e108
  round 0.254 hole 0.254: 56(0,0)
Pad_e109
  round 0.254 hole 0.254: 57(0,0)
Pad_e110
  round 0.254 hole 0.254: 58(0,0)
Pad_e111
  round 0.254 hole 0.254: 59(0,0)
Pad_e112
  round 0.254 hole 0.254: 60(0,0)
Pad_e113
  round 0.254 hole 0.254: 61(0,0)
Pad_e114
  round 0.254 hole 0.254: 62(0,0)
Pad_e115
  round 0.254 hole 0.254: 63(0,0)
Pad_e116
  round 0.254 hole 0.254: 64(0,0)
Pad_e117
  round 0.254 hole 0.254: 65(0,0)
Pad_e118
  round 0.254 hole 0.254: 66(0,0)
Pad_e119
  round 0.254 hole 0.254: 67(0,0)
Pad_e163
  round 0.254 hole 0.254: 68(0,0)
Pad_e164
  round 0.254 hole 0.254: 69(0,0)
Pad_e180
  round 0.254 hole 0.254: 70(0,0)
Pad_e182
  round 0.254 hole 0.254: 72(0,0)
Pad_e183
  round 0.254 hole 0.254: 73(0,0)
Pad_e184
  round 0.254 hole 0.254: 74(0,0)
Pad_e206
  round 0.254 hole 0.254: 71(0,0)
Pad_e207
  round 0.254 hole 0.254: 75(0,0)
Pad_e217
  round 0.254 hole 0.254: 76(0,0)
Pad_e218
  round 0.254 hole 0.254: 77(0,0)
SOT-223-4_L6.5-W3.5-P2.30-LS7.0-BR
  rect 2.47x0.98 smd: 1(2.835,-2.3) 2(2.835,0) 3(2.835,2.3)
  rect 2.47x3.6 smd: 4(-2.835,0)
SW-SMD_L6.0-W3.3-LS8.0
  rect 1.9x1.5 smd: 1(-4,0) 2(4,0)
USB-SMD_AM180
  rect 1.35x3.2 smd: 1(3.5,1.36) 2(1,1.36) 3(-1,1.36) 4(-3.5,1.36)
  oval 1.5x3.5 hole 0.9x2.6: 5(-5.75,-1.36) 5(5.75,-1.36)

## Nets
GND: C1.1 C2.1 C3.1 C4.1 H1.4 NOREF#22.74 SW1.1 U1.8 U1.23 U1.35 U1.44 U1.47 U2.1 USB1.4
VCC: H1.1 NOREF.71 NOREF#14.75 U1.1 U1.9 U1.24 U1.36 U1.48 U2.2
$3N746: NOREF#18.50 NOREF#27.49 U2.3 USB1.1
$3N1161: H1.3 U1.37
$3N1166: H1.2 U1.34
$3N1666: C1.2 NOREF#33.76 U1.3 X1.2
$3N1672: C2.2 NOREF#4.77 U1.4 X1.1
$3N1678: C3.2 U1.5 X2.1
$3N1684: C4.2 U1.6 X2.2
$3N2120: SW1.2 U1.7
$3N2429: H2.1 U1.10
$3N2434: H2.2 U1.11
$3N2444: H2.3 U1.12
$3N2454: H2.4 U1.13
$3N2466: H2.5 U1.14
$3N2478: H2.6 U1.15
$3N2490: H2.7 U1.16
$3N2502: H2.8 U1.17
$3N2512: H2.9 U1.18
$3N2522: H2.10 U1.19
$3N2532: H2.11 U1.20
$3N2544: H2.12 U1.21
$3N2554: H2.13 U1.22
$3N2566: H2.14 U1.25
$3N2574: H2.15 NOREF#2.52 NOREF#8.52 NOREF#11.52 NOREF#15.51 NOREF#17.53 NOREF#24.52 NOREF#26.54 NOREF#28.51 NOREF#29.52 NOREF#31.52 NOREF#32.52 NOREF#34.52 NOREF#37.52 NOREF#38.52 NOREF#40.52 U1.26
$3N2672: H3.1 NOREF#23.55 U1.29
$3N2687: H3.2 NOREF#19.56 U1.30
$3N2690: H3.3 NOREF#3.57 U1.31
$3N2693: H3.4 NOREF#30.58 U1.32
$3N2713: H3.5 NOREF#12.59 U1.33
$3N2720: H3.6 NOREF#13.60 U1.38
$3N2725: H3.7 NOREF#21.61 U1.39
$3N2730: H3.8 NOREF#35.62 U1.40
$3N2735: H3.9 NOREF#36.63 U1.41
$3N2740: H3.10 NOREF#25.64 U1.42
$3N2746: H3.11 NOREF#5.65 U1.43
$3N2751: H3.12 NOREF#9.66 U1.45
$3N2756: H3.13 NOREF#39.67 U1.46
$3N2761: H3.14 NOREF#7.69 NOREF#10.70 NOREF#16.73 NOREF#20.72 U1.27
$3N2768: H3.15 NOREF#6.68 U1.28

Pads without a net: U1 2; U2 4; USB1 2 3 5

## Routing (per net, layer and track width the routed paths; a pad name or vN(x,y) marks a point on that pad's centre or on a via; arc(x,y) is an arc through that point)
VCC: length 50.4
  Top Layer w0.2: H1.1 41.75,57.57 U1.36 ; 41.78,42.44 41.78,41.53 42.8,40.51 46.14,40.51 46.14,36.36 45.72,35.94 45.72,35.05 ; 46.1,40.51 46.1,39.5 41.78,35.18 ; 47.2,41.57 48.26,41.57
  Top Layer w0.254: 46.1,40.51 46.14,40.51 49.15,43.52 49.15,49.09 53.28,53.21
$3N1161: length 18.2
  Top Layer w0.2: H1.3 40.25,53.99 U1.37
$3N1166: length 20.2
  Top Layer w0.2: H1.2 40.64,59.94 41.28,59.94 42.16,59.05 42.16,44.2 42.67,43.69
$3N1678: length 18.7
  Top Layer w0.2: X2.1 39.92,23.06 39.92,17.28 ; U1.5 43.75,28.13 39.24,23.62
$3N1684: length 18.5
  Top Layer w0.2: U1.6 44.25,28.27 48.51,24 ; X2.2 48.77,17.08 C4.2
$3N2120: length 14.8
  Top Layer w0.2: U1.7 44.75,32.6 53.85,23.49
$3N2429: length 29.4
  Top Layer w0.254: 46.23,34.04 46.23,32.51
  Bottom Layer w0.254: 46.23,32.51 46.23,29.21 52.58,22.86 H2.1
$3N2434: length 24.7
  Bottom Layer w0.254: 46.74,31.75 46.74,29.84 50.45,25.91 67.82,25.91
$3N2444: length 22.2
  Bottom Layer w0.254: 47.24,30.99 50.16,28.07 68.2,28.07
$3N2454: length 20.3
  Bottom Layer w0.254: 50.16,35.94 62.74,35.94 H2.4
$3N2466: length 19.5
  Bottom Layer w0.254: 50.16,36.45 64.77,36.45 H2.5
$3N2478: length 20.1
  Top Layer w0.2: U1.15 50.06,37.06 50.16,36.96
  Bottom Layer w0.254: 50.16,36.96 66.8,36.96 H2.6
$3N2490: length 19.8
  Top Layer w0.2: U1.16 50.06,37.56 50.16,37.46
  Bottom Layer w0.254: 50.16,37.46 67.56,37.46 H2.7
$3N2502: length 20.5
  Top Layer w0.2: U1.17 50.07,38.06 50.16,37.97
  Bottom Layer w0.254: 50.16,37.97 65.64,37.97 68.2,40.53
$3N2512: length 21.4
  Top Layer w0.2: U1.18 50.08,38.56 50.16,38.48
  Bottom Layer w0.254: 50.16,38.48 63.5,38.48 H2.9
$3N2522: length 22.3
  Top Layer w0.2: U1.19 50.09,39.06 50.16,38.99
  Bottom Layer w0.254: 50.16,38.99 61.47,38.99 H2.10
$3N2532: length 23.1
  Top Layer w0.2: U1.20 50.1,39.56 50.16,39.5
  Bottom Layer w0.254: 50.16,39.5 59.44,39.5 H2.11
$3N2544: length 23.9
  Top Layer w0.2: U1.21 50.11,40.06 50.16,40
  Bottom Layer w0.254: 50.16,40 57.4,40 H2.12
$3N2554: length 1.4
  Top Layer w0.2: U1.22 50.11,40.56 50.16,40.51
$3N2566: length 25.1
  Bottom Layer w0.254: 47.88,44.45 56.77,44.45 H2.14
$3N2720: length 20.1
  Top Layer w0.2: NOREF.60 39.58,41.06 U1.38
  Bottom Layer w0.2: H3.6 35.69,44.96 NOREF.60

## Copper pours and planes (outline as drawn; the poured copper is in the pictures)
GND on Bottom Layer: 13.21,62.86 75.44,62.86 75.44,11.18 13.21,11.18

# Board PCB2
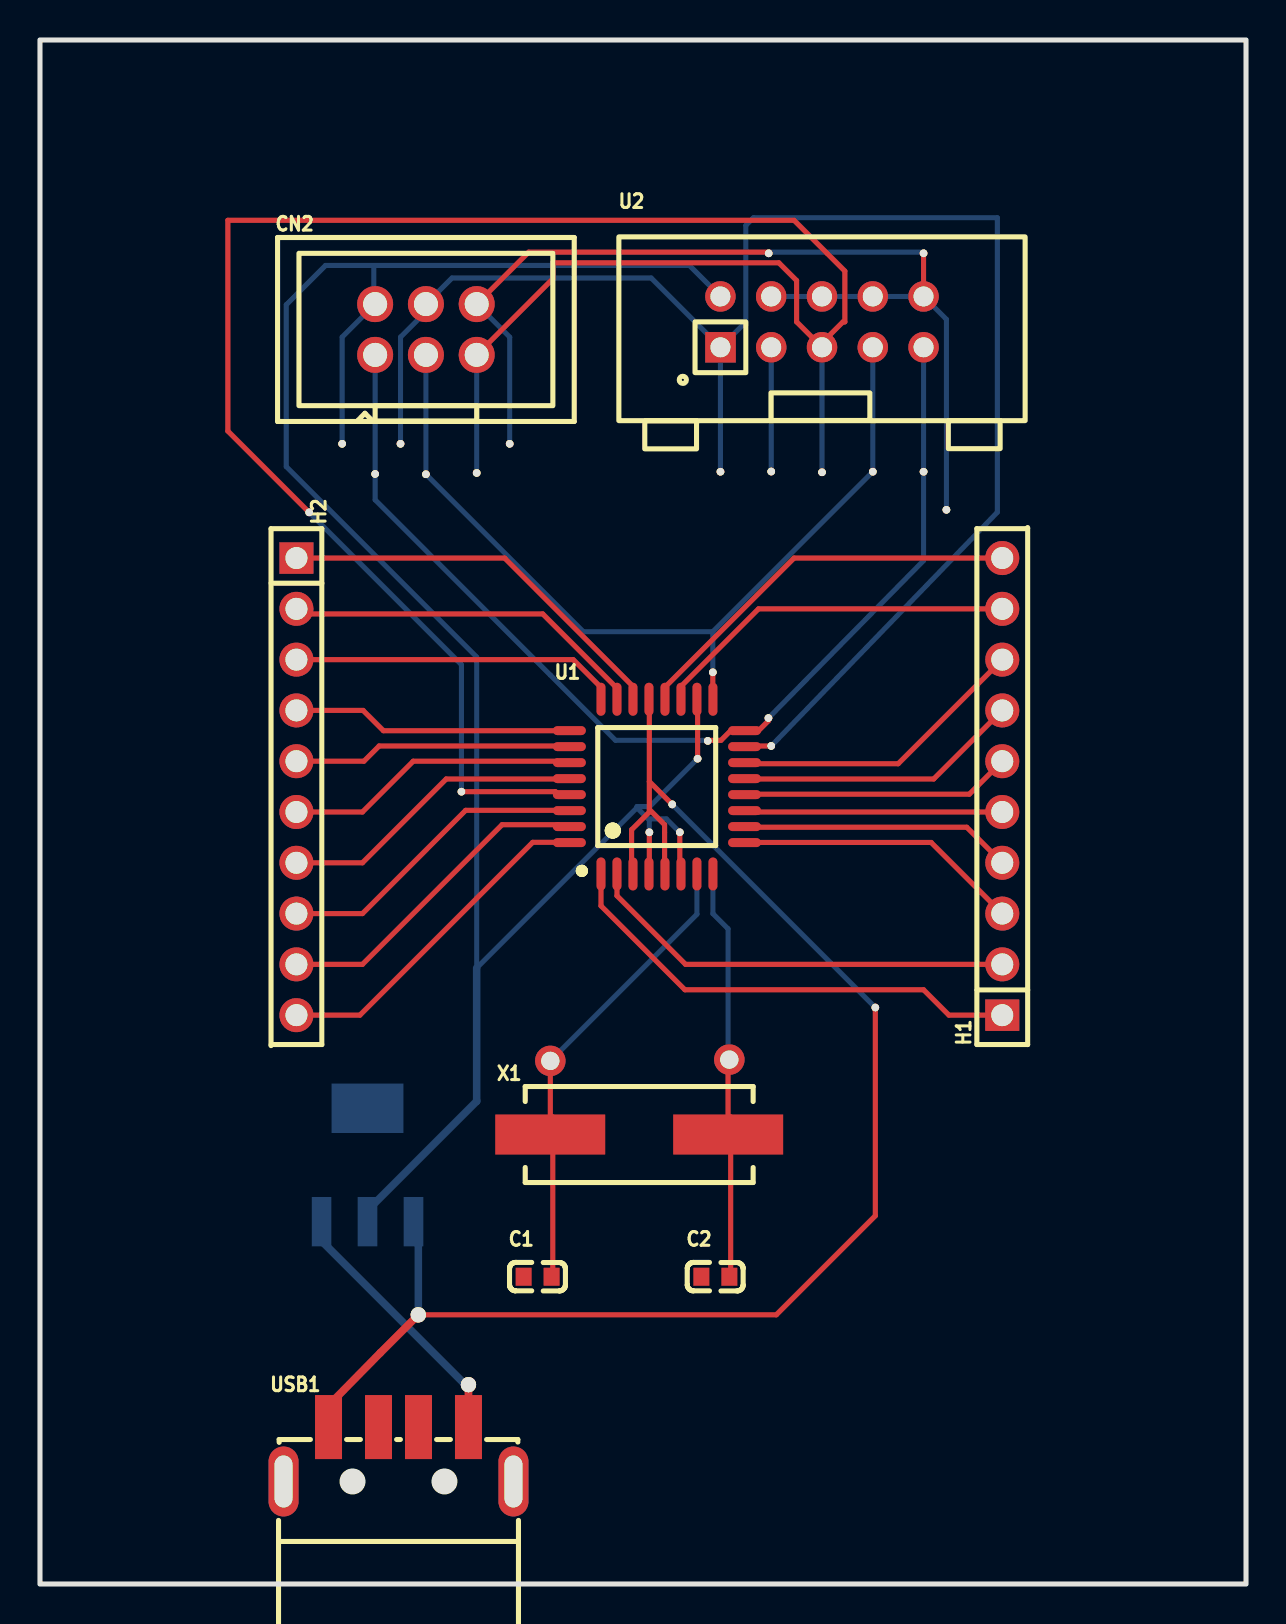
[diagram p4: board, top side]
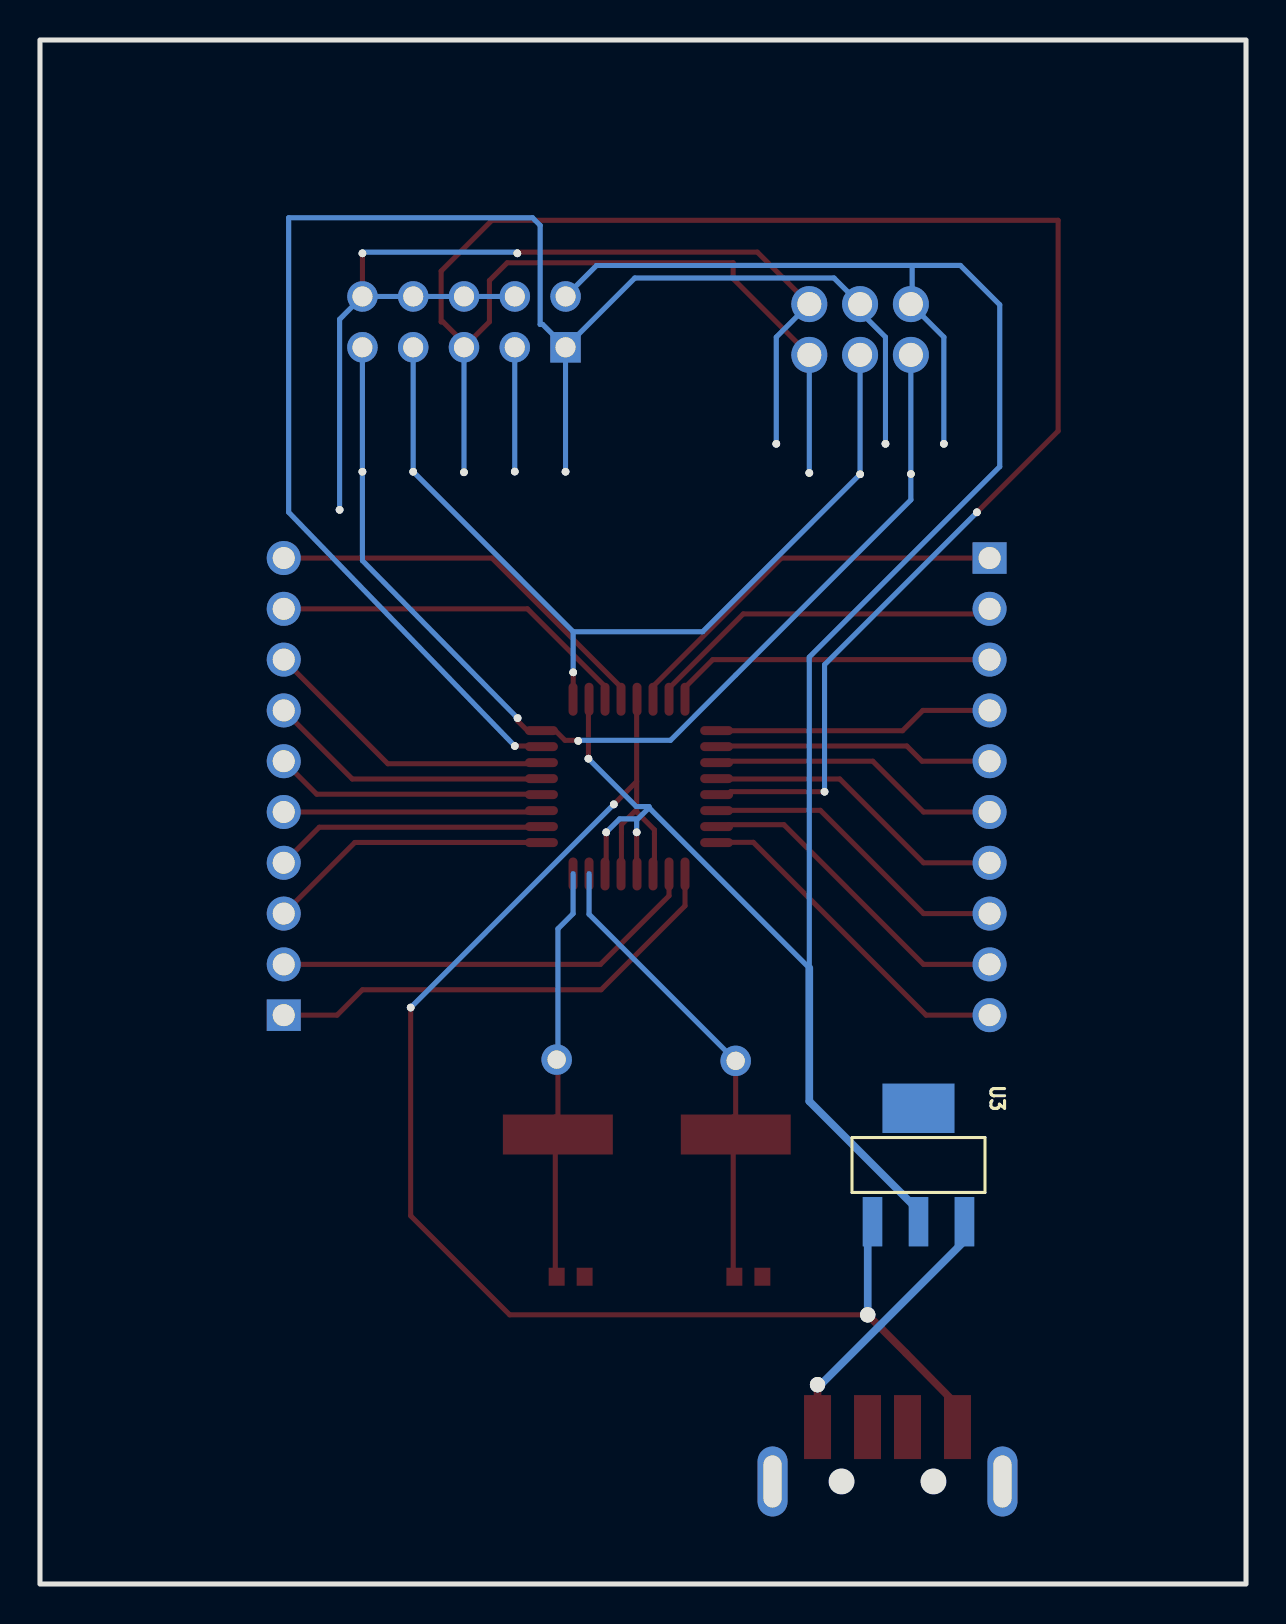
[diagram p5: board, bottom side, seen from below]

Outline 60.32 x 77.22 mm; copper layers: Top Layer, Bottom Layer. Coordinates in mm from the lower left corner of the outline.
Outline path: rectangle 0,77.22 60.32,0
Stack: Top Layer 0.035mm - / Dielectric1 1.51mm FR4 er 4.5 / Bottom Layer 0.035mm -

## Design rules (mm)
template: JLCPCB Capability(Two Layers Board)
spacing copperThickness1oz (default): track to track 0.102, other pairs 0.152 to 0.3
spacing copperThickness2oz: track to track 0.203, other pairs 0.152 to 0.3
track width copperThickness1oz (default): min 0.127, default 0.254, max 2.54
track width copperThickness2oz: min 0.203, default 0.254, max 2.54
differential pair differentialPair (default): width min 0.127, default 0.254, max 2.54; gap min 0.152, default 0.152
via viaSize (default): diameter min 0.5, default 0.61, max 10; hole min 0.3, default 0.305, max 6.3

## Placement (name value [footprint] x y rotation side)
C1  22pF  [C0603]  24.89 15.37 0 top
C2  22pF  [C0603]  33.78 15.37 0 top
CN2  75869-131LF  [CONN-TH_6P-P2.54_75869-131LF]  19.3 62.74 0 top
H1  PZ254-1-10-Z-8.5  [HDR-TH_10P-P2.54-V-M]  48.13 39.88 90 top
H2  PZ254-1-10-Z-8.5  [HDR-TH_10P-P2.54-V-M]  12.83 39.88 270 top
NOREF  -  [Pad_e204]  44.2 66.55 0 top
NOREF#2  -  [Pad_e60]  25.53 26.16 0 top
NOREF#3  -  [Pad_e148]  41.66 55.63 0 top
NOREF#4  -  [Pad_e104]  30.48 37.59 0 top
NOREF#5  -  [Pad_e171]  39.12 55.6 0 top
NOREF#6  -  [Pad_e144]  36.58 55.63 0 top
NOREF#7  -  [Pad_e84]  18.92 13.46 0 top
NOREF#8  -  [Pad_e186]  36.44 43.3 0 top
NOREF#9  -  [Pad_e143]  34.04 55.63 0 top
NOREF#10  -  [Pad_e190]  41.78 28.83 0 top
NOREF#11  -  [Pad_e103]  32.89 41.28 0 top
NOREF#12  -  [Pad_e185]  33.4 42.16 0 top
NOREF#13  -  [Pad_e68]  34.48 26.23 0 top
NOREF#14  -  [Pad_e191]  31.62 38.99 0 top
NOREF#15  -  [Pad_e151]  45.34 53.72 0 top
NOREF#16  -  [Pad_e126]  16.76 55.51 0 top
NOREF#17  -  [Pad_e123]  15.11 57.02 0 top
NOREF#18  -  [Pad_e210]  13.46 53.59 0 top
NOREF#19  -  [Pad_e150]  44.2 55.63 0 top
NOREF#20  -  [Pad_e130]  21.84 55.57 0 top
NOREF#21  -  [Pad_e203]  36.45 66.55 0 top
NOREF#22  -  [Pad_e197]  36.58 41.91 0 top
NOREF#23  -  [Pad_e179]  33.66 45.59 0 top
NOREF#24  -  [Pad_e102]  32 37.59 0 top
NOREF#25  -  [Pad_e213]  21.08 39.62 0 top
NOREF#26  -  [Pad_e129]  19.3 55.5 0 top
NOREF#27  -  [Pad_e158]  23.5 57.02 0 top
NOREF#28  -  [Pad_e124]  18.03 57.02 0 top
NOREF#29  -  [Pad_e82]  21.43 9.97 0 top
U1  ATMEGA48PA-AU  [TQFP-32_L7.0-W7.0-P0.80-LS9.0-BL]  30.86 39.88 0 top
U2  1761608-3  [IDC-TH_10P-P2.54-S2.54_L9.2-W20.3]  39.12 63.12 0 top
U3  AMS1117-3.3  [SOT-223-4_L6.5-W3.5-P2.30-LS7.0-BR]  16.38 20.96 270 bottom
USB1  AM 180°  [USB-SMD_AM180]  17.93 6.49 0 top
X1  8MHz  [CRYSTAL-SMD_L11.5-W4.8-LS12.7]  29.97 22.48 0 top

## Footprints (pads in the part's own frame, mm; a bottom-side part is the same pattern mirrored in y, then rotated)
C0603
  rect 0.8x0.9 smd: 1(-0.7,0) 2(0.7,0)
CONN-TH_6P-P2.54_75869-131LF
  round 1.8 hole 1.2: 1(-2.54,-1.27) 2(-2.54,1.27) 3(0,-1.27) 4(0,1.27) 5(2.54,-1.27) 6(2.54,1.27)
CRYSTAL-SMD_L11.5-W4.8-LS12.7
  rect 5.5x2 smd: 1(-4.45,0) 2(4.45,0)
HDR-TH_10P-P2.54-V-M
  rect 1.575x1.7 hole 1.1: 1(-11.43,0)
  round 1.7 hole 1.1: 2(-8.89,0) 3(-6.35,0) 4(-3.81,0) 5(-1.27,0) 6(1.27,0) 7(3.81,0) 8(6.35,0) 9(8.89,0) 10(11.43,0)
IDC-TH_10P-P2.54-S2.54_L9.2-W20.3
  rect 1.524x1.524 hole 1: 1(-5.079,-1.272)
  round 1.524 hole 1: 2(-5.081,1.272) 3(-2.539,-1.27) 4(-2.541,1.272) 5(0.001,-1.27) 6(-0.001,1.272) 7(2.541,-1.27) 8(2.539,1.272) 9(5.081,-1.27) 10(5.079,1.272)
Pad_e60
  round 1.524 hole 0.914: 33(0,0)
Pad_e68
  round 1.524 hole 0.914: 34(0,0)
Pad_e82
  round 0.762 hole 0.914: 35(0,0)
Pad_e84
  round 0.762 hole 0.914: 36(0,0)
Pad_e102
  round 0.381 hole 0.381: 37(0,0)
Pad_e103
  round 0.381 hole 0.381: 37(0,0)
Pad_e104
  round 0.381 hole 0.381: 37(0,0)
Pad_e123
  round 0.381 hole 0.381: 38(0,0)
Pad_e124
  round 0.381 hole 0.381: 39(0,0)
Pad_e126
  round 0.381 hole 0.381: 41(0,0)
Pad_e129
  round 0.381 hole 0.381: 42(0,0)
Pad_e130
  round 0.381 hole 0.381: 43(0,0)
Pad_e143
  round 0.381 hole 0.381: 45(0,0)
Pad_e144
  round 0.381 hole 0.381: 46(0,0)
Pad_e148
  round 0.381 hole 0.381: 50(0,0)
Pad_e150
  round 0.381 hole 0.381: 52(0,0)
Pad_e151
  round 0.381 hole 0.381: 53(0,0)
Pad_e158
  round 0.381 hole 0.381: 54(0,0)
Pad_e171
  round 0.381 hole 0.381: 37(0,0)
Pad_e179
  round 0.381 hole 0.381: 40(0,0)
Pad_e185
  round 0.381 hole 0.381: 44(0,0)
Pad_e186
  round 0.381 hole 0.381: 47(0,0)
Pad_e190
  round 0.381 hole 0.381: 48(0,0)
Pad_e191
  round 0.381 hole 0.381: 49(0,0)
Pad_e197
  round 0.381 hole 0.381: 51(0,0)
Pad_e203
  round 0.381 hole 0.381: 55(0,0)
Pad_e204
  round 0.381 hole 0.381: 56(0,0)
Pad_e210
  round 0.381 hole 0.381: 57(0,0)
Pad_e213
  round 0.381 hole 0.381: 58(0,0)
SOT-223-4_L6.5-W3.5-P2.30-LS7.0-BR
  rect 2.47x0.98 smd: 1(2.835,-2.3) 2(2.835,0) 3(2.835,2.3)
  rect 2.47x3.6 smd: 4(-2.835,0)
TQFP-32_L7.0-W7.0-P0.80-LS9.0-BL
  oval 0.45x1.65 smd: 1(-2.8,-4.369) 2(-2,-4.369) 3(-1.2,-4.369) 4(-0.4,-4.369) 5(0.4,-4.369) 6(1.2,-4.369) 7(2,-4.369) 8(2.8,-4.369) 17(2.8,4.369) 18(2,4.369) 19(1.2,4.369) 20(0.4,4.369) 21(-0.4,4.369) 22(-1.2,4.369) 23(-2,4.369) 24(-2.8,4.369)
  oval 1.65x0.45 smd: 9(4.381,-2.8) 10(4.381,-2) 11(4.381,-1.2) 12(4.381,-0.4) 13(4.381,0.4) 14(4.381,1.2) 15(4.381,2) 16(4.381,2.8) 25(-4.381,2.8) 26(-4.381,2) 27(-4.381,1.2) 28(-4.381,0.4) 29(-4.381,-0.4) 30(-4.381,-1.2) 31(-4.381,-2) 32(-4.381,-2.8)
USB-SMD_AM180
  rect 1.35x3.2 smd: 1(3.5,1.36) 2(1,1.36) 3(-1,1.36) 4(-3.5,1.36)
  oval 1.5x3.5 hole 0.9x2.6: 5(-5.75,-1.36) 5(5.75,-1.36)

## Nets
GND: C1.1 C2.1 CN2.6 NOREF.56 NOREF#7.36 NOREF#10.48 NOREF#14.49 NOREF#15.53 NOREF#21.55 NOREF#27.54 U1.3 U1.5 U1.21 U2.4 U2.6 U2.8 U2.10 U3.1 USB1.4
VCC: CN2.2 NOREF#4.37 NOREF#11.37 NOREF#17.38 NOREF#24.37 NOREF#29.35 U1.4 U1.6 U1.18 U2.2 U3.3 USB1.1
$2N830: CN2.4 NOREF#6.46 NOREF#9.45 NOREF#22.51 NOREF#28.39 U1.15 U2.1
$2N839: CN2.1 NOREF#8.47 NOREF#12.44 NOREF#16.41 NOREF#19.52 U1.16 U2.9
$2N858: CN2.3 NOREF#3.50 NOREF#23.40 NOREF#26.42 U1.17 U2.7
$2N878: CN2.5 NOREF#5.37 NOREF#18.57 NOREF#20.43 NOREF#25.58 U1.29 U2.5
$2N1111: C1.2 U1.7 X1.1
$2N1119: C2.2 U1.8 X1.2
$2N1346: H1.1 U1.1
$2N1350: H1.2 U1.2
$2N1360: H1.3 U1.9
$2N1374: H1.4 U1.10
$2N1380: H1.5 U1.11
$2N1390: H1.6 U1.12
$2N1398: H1.7 U1.13
$2N1410: H1.8 U1.14
$2N1422: H1.9 U1.19
$2N1434: H1.10 U1.20
$2N1448: H2.1 U1.22
$2N1452: H2.2 U1.23
$2N1456: H2.3 U1.24
$2N1460: H2.4 U1.25
$2N1464: H2.5 U1.26
$2N1472: H2.6 U1.27
$2N1480: H2.7 U1.28
$2N1488: H2.8 U1.30
$2N1496: H2.9 U1.31
$2N1514: H2.10 U1.32

Pads without a net: NOREF#2 33; NOREF#13 34; U2 3; U3 2 4; USB1 2 3 5

## Routing (per net, layer and track width the routed paths; a pad name or vN(x,y) marks a point on that pad's centre or on a via; arc(x,y) is an arc through that point)
$2N1111: length 10.8
  Top Layer w0.254: 25.53,26.16 25.53,23.37 ; 25.65,23.37 25.65,15.42 C1.2
$2N1119: length 11.1
  Top Layer w0.254: 34.42,26.29 34.42,23.26 ; 34.55,23.37 34.55,15.43 C2.2
$2N1346: length 23.9
  Top Layer w0.254: 28.06,35.51 28.06,33.92 32.26,29.72 44.2,29.72 45.47,28.45 H1.1
$2N1350: length 21.8
  Top Layer w0.254: U1.2 28.86,34.42 32.29,30.99 H1.2
$2N1360: length 13.7
  Top Layer w0.254: 35.94,37.08 44.58,37.08 48.13,33.53
$2N1374: length 13.1
  Top Layer w0.254: 35.81,37.85 46.35,37.85 H1.4
$2N1380: length 12.4
  Top Layer w0.254: 35.81,38.74 35.94,38.61 48.13,38.61
$2N1390: length 13
  Top Layer w0.254: 35.81,39.5 46.48,39.5 H1.6
$2N1398: length 13.7
  Top Layer w0.254: 35.81,40.26 44.7,40.26 H1.7
$2N1410: length 14.5
  Top Layer w0.254: 35.81,41.02 42.93,41.02 H1.8
$2N1422: length 17.6
  Top Layer w0.254: 32.13,44.96 35.94,48.77 H1.9
$2N1434: length 19.6
  Top Layer w0.254: 31.24,44.83 37.72,51.31 48.13,51.31
$2N1448: length 19.4
  Top Layer w0.254: 12.83,51.31 23.24,51.31 29.59,44.96
$2N1452: length 17.5
  Top Layer w0.254: 12.83,48.51 25.15,48.51 28.83,44.83
$2N1456: length 15.8
  Top Layer w0.254: H2.3 26.67,46.23 28.06,44.84
$2N1460: length 13.5
  Top Layer w0.254: H2.4 16.16,43.69 17.18,42.67 25.91,42.67
$2N1464: length 13.4
  Top Layer w0.254: H2.5 16.2,41.15 16.97,41.91 25.91,41.91
$2N1472: length 14.1
  Top Layer w0.254: 12.83,38.61 16.13,38.61 18.67,41.15 25.91,41.15
$2N1480: length 14.8
  Top Layer w0.254: H2.7 16.13,36.07 20.32,40.26 25.91,40.26
$2N1488: length 15.3
  Top Layer w0.254: 12.83,33.53 16.13,33.53 21.29,38.69 25.96,38.69
$2N1496: length 16
  Top Layer w0.254: H2.9 16.13,30.99 23.11,37.97 25.91,37.97
$2N1514: length 16.7
  Top Layer w0.254: H2.10 16,28.45 24.65,37.09 25.92,37.09

## Copper pours and planes (outline as drawn; the poured copper is in the pictures)
GND on Bottom Layer: 8.25,69.6 52.7,69.6 52.7,11.3 8.25,11.3
